# Altium project RK3568_train.PrjPcb (part 5 of 6)

## Sheet LPDDR4_4X.schdoc: =
size A3; Symbol: Sheet-Symbol_A4; Company: 嘉立创EDA; Version: V1.0; Page Size: A4; @Project Name: RK3568_LPD4X_120P_Core; @Page Count: 17; @Update Date: 2025-08-20; @Create Date: 2025-08-15; @Schematic Name: Schematic1; @Page No: 16; @Page Name: LPDDR4/4X; Device: Sheet-Symbol_A4; Border: 1; Title Block Position: 3; Width: 1655; Height: 1170; Region Start: 1; X Region Count: 6; Y Region Count: 4; Blade Width: 10; @Board Name: Board1; @Create Time: 13:51:49; @Update Time: 20:30:34; Organization: ORGANIZATION; Address1: ADDRESS 1; Address2: ADDRESS 2; Address3: ADDRESS 3; Address4: ADDRESS 4; Revision: V1.0.0; SheetNumber: 22; SheetTotal: 28
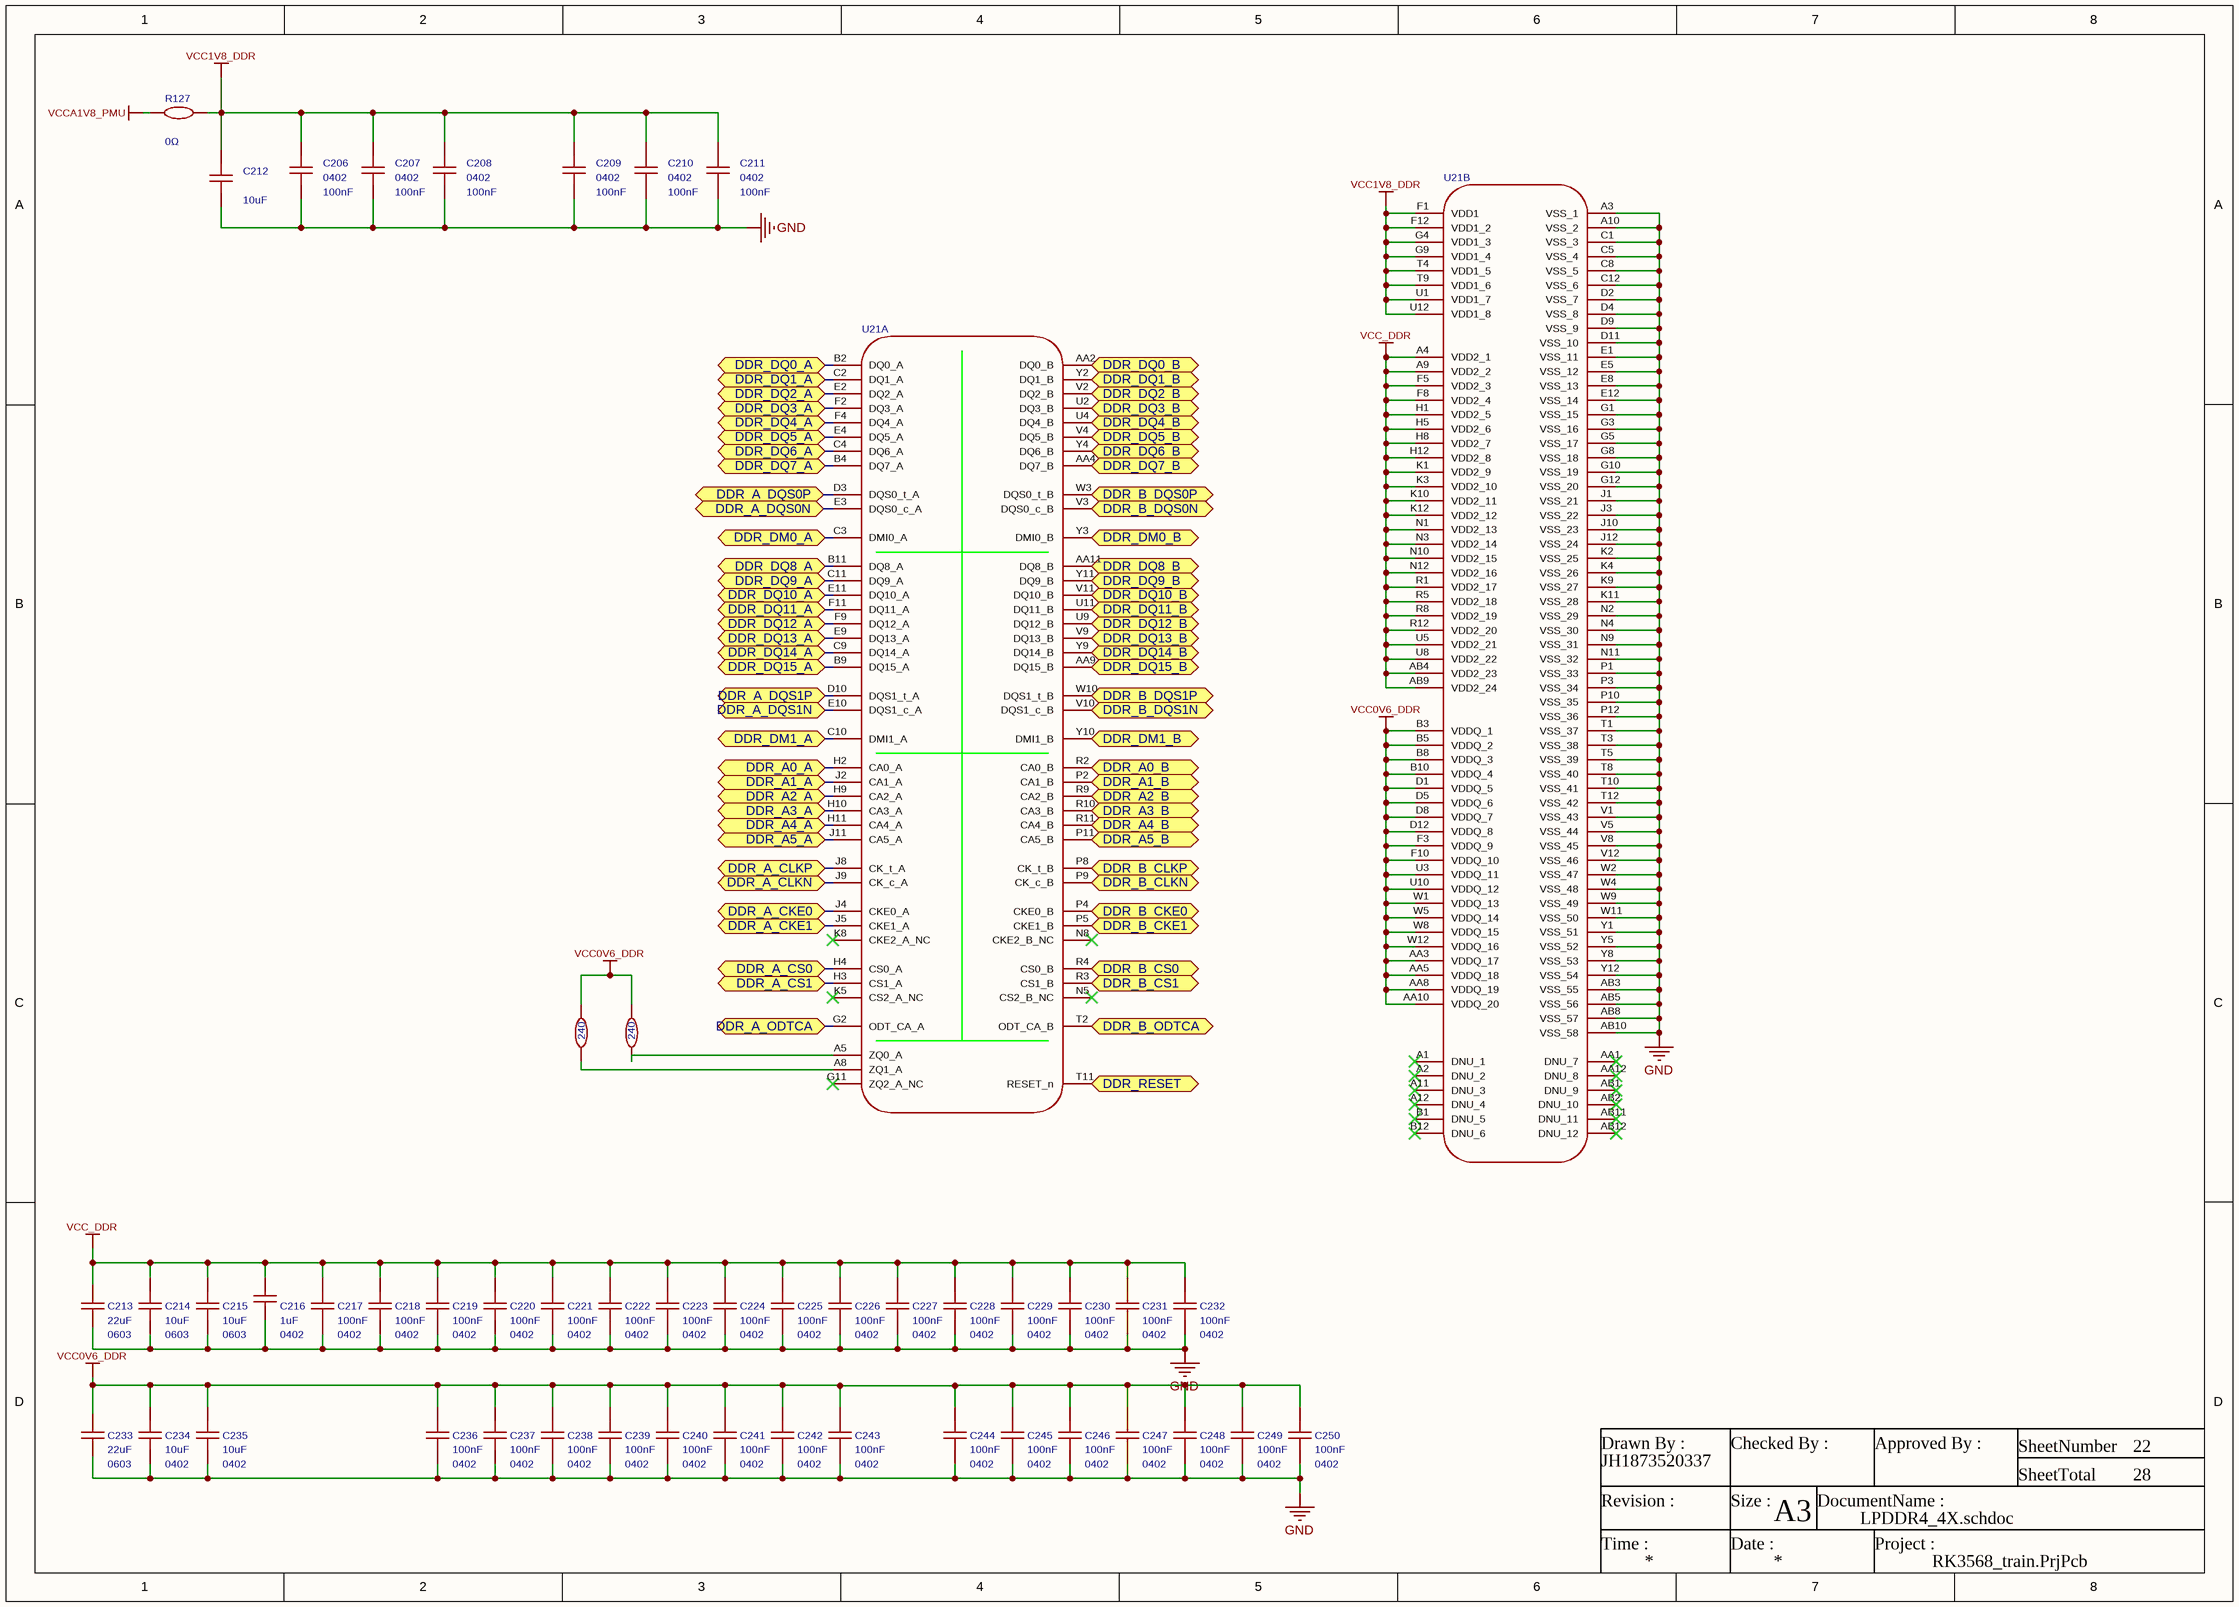
[diagram p21: LPDDR4_4X.schdoc]

### Parts
C206  100nF  Supplier Footprint: 0402  [MYC0402]
C207  100nF  Supplier Footprint: 0402  [MYC0402]
C208  100nF  Supplier Footprint: 0402  [MYC0402]
C209  100nF  Supplier Footprint: 0402  [MYC0402]
C210  100nF  Supplier Footprint: 0402  [MYC0402]
C211  100nF  Supplier Footprint: 0402  [MYC0402]
C212  10uF  [C0603]
C213  22uF  Supplier Footprint: 0603  [C0603]
C214  10uF  Supplier Footprint: 0603  [C0603]
C215  10uF  Supplier Footprint: 0603  [C0603]
C216  1uF  Supplier Footprint: 0402  [MYC0402]
C217  100nF  Supplier Footprint: 0402  [MYC0402]
C218  100nF  Supplier Footprint: 0402  [MYC0402]
C219  100nF  Supplier Footprint: 0402  [MYC0402]
C220  100nF  Supplier Footprint: 0402  [MYC0402]
C221  100nF  Supplier Footprint: 0402  [MYC0402]
C222  100nF  Supplier Footprint: 0402  [MYC0402]
C223  100nF  Supplier Footprint: 0402  [MYC0402]
C224  100nF  Supplier Footprint: 0402  [MYC0402]
C225  100nF  Supplier Footprint: 0402  [MYC0402]
C226  100nF  Supplier Footprint: 0402  [MYC0402]
C227  100nF  Supplier Footprint: 0402  [MYC0402]
C228  100nF  Supplier Footprint: 0402  [MYC0402]
C229  100nF  Supplier Footprint: 0402  [MYC0402]
C230  100nF  Supplier Footprint: 0402  [MYC0402]
C231  100nF  Supplier Footprint: 0402  [MYC0402]
C232  100nF  Supplier Footprint: 0402  [MYC0402]
C233  22uF  Supplier Footprint: 0603  [C0603]
C234  10uF  Supplier Footprint: 0402  [MYC0402]
C235  10uF  Supplier Footprint: 0402  [MYC0402]
C236  100nF  Supplier Footprint: 0402  [MYC0402]
C237  100nF  Supplier Footprint: 0402  [MYC0402]
C238  100nF  Supplier Footprint: 0402  [MYC0402]
C239  100nF  Supplier Footprint: 0402  [MYC0402]
C240  100nF  Supplier Footprint: 0402  [MYC0402]
C241  100nF  Supplier Footprint: 0402  [MYC0402]
C242  100nF  Supplier Footprint: 0402  [MYC0402]
C243  100nF  Supplier Footprint: 0402  [MYC0402]
C244  100nF  Supplier Footprint: 0402  [MYC0402]
C245  100nF  Supplier Footprint: 0402  [MYC0402]
C246  100nF  Supplier Footprint: 0402  [MYC0402]
C247  100nF  Supplier Footprint: 0402  [MYC0402]
C248  100nF  Supplier Footprint: 0402  [MYC0402]
C249  100nF  Supplier Footprint: 0402  [MYC0402]
C250  100nF  Supplier Footprint: 0402  [MYC0402]
R127  0Ω  [R0603]
R128  value 240  [r0402-nsk]  (hidden comment: Res_0402)
R129  value 240  [r0402-nsk]  (hidden comment: Res_0402)
U21  LPDDR4  [LPDDR4_MrX]  (value not drawn)  (parts A,B of 2)

### Ports
DDR_A0_A (bidir), DDR_A0_B (bidir), DDR_A1_A (bidir), DDR_A1_B (bidir), DDR_A2_A (bidir), DDR_A2_B (bidir), DDR_A3_A (bidir), DDR_A3_B (bidir), DDR_A4_A (bidir), DDR_A4_B (bidir), DDR_A5_A (bidir), DDR_A5_B (bidir), DDR_A_CKE0 (bidir), DDR_A_CKE1 (bidir), DDR_A_CLKN (bidir), DDR_A_CLKP (bidir), DDR_A_CS0 (bidir), DDR_A_CS1 (bidir), DDR_A_DQS0N (bidir), DDR_A_DQS0P (bidir), DDR_A_DQS1N (bidir), DDR_A_DQS1P (bidir), DDR_A_ODTCA (bidir), DDR_B_CKE0 (bidir), DDR_B_CKE1 (bidir), DDR_B_CLKN (bidir), DDR_B_CLKP (bidir), DDR_B_CS0 (bidir), DDR_B_CS1 (bidir), DDR_B_DQS0N (bidir), DDR_B_DQS0P (bidir), DDR_B_DQS1N (bidir), DDR_B_DQS1P (bidir), DDR_B_ODTCA (bidir), DDR_DM0_A (bidir), DDR_DM0_B (bidir), DDR_DM1_A (bidir), DDR_DM1_B (bidir), DDR_DQ0_A (bidir), DDR_DQ0_B (bidir), DDR_DQ1_A (bidir), DDR_DQ1_B (bidir), DDR_DQ2_A (bidir), DDR_DQ2_B (bidir), DDR_DQ3_A (bidir), DDR_DQ3_B (bidir), DDR_DQ4_A (bidir), DDR_DQ4_B (bidir), DDR_DQ5_A (bidir), DDR_DQ5_B (bidir), DDR_DQ6_A (bidir), DDR_DQ6_B (bidir), DDR_DQ7_A (bidir), DDR_DQ7_B (bidir), DDR_DQ8_A (bidir), DDR_DQ8_B (bidir), DDR_DQ9_A (bidir), DDR_DQ9_B (bidir), DDR_DQ10_A (bidir), DDR_DQ10_B (bidir), DDR_DQ11_A (bidir), DDR_DQ11_B (bidir), DDR_DQ12_A (bidir), DDR_DQ12_B (bidir), DDR_DQ13_A (bidir), DDR_DQ13_B (bidir), DDR_DQ14_A (bidir), DDR_DQ14_B (bidir), DDR_DQ15_A (bidir), DDR_DQ15_B (bidir), DDR_RESET (bidir)

### Nets
GND: C206.1 C207.1 C208.1 C209.1 C210.1 C211.1 C212.1 C213.1 C214.1 C215.1 C216.1 C217.2 C218.2 C219.2 C220.2 C221.2 C222.2 C223.2 C224.2 C225.2 C226.2 C227.2 C228.2 C229.2 C230.2 C231.2 C232.2 C233.1 C234.1 C235.1 C236.2 C237.2 C238.2 C239.2 C240.2 C241.2 C242.2 C243.2 C244.2 C245.2 C246.2 C247.2 C248.2 C249.2 C250.2 U21.A3(VSS_1) U21.A10(VSS_2) U21.AB3(VSS_55) U21.AB5(VSS_56) U21.AB8(VSS_57) U21.AB10(VSS_58) U21.C1(VSS_3) U21.C5(VSS_4) U21.C8(VSS_5) U21.C12(VSS_6) U21.D2(VSS_7) U21.D4(VSS_8) U21.D9(VSS_9) U21.D11(VSS_10) U21.E1(VSS_11) U21.E5(VSS_12) U21.E8(VSS_13) U21.E12(VSS_14) U21.G1(VSS_15) U21.G3(VSS_16) U21.G5(VSS_17) U21.G8(VSS_18) U21.G10(VSS_19) U21.G12(VSS_20) U21.J1(VSS_21) U21.J3(VSS_22) U21.J10(VSS_23) U21.J12(VSS_24) U21.K2(VSS_25) U21.K4(VSS_26) U21.K9(VSS_27) U21.K11(VSS_28) U21.N2(VSS_29) U21.N4(VSS_30) U21.N9(VSS_31) U21.N11(VSS_32) U21.P1(VSS_33) U21.P3(VSS_34) U21.P10(VSS_35) U21.P12(VSS_36) U21.T1(VSS_37) U21.T3(VSS_38) U21.T5(VSS_39) U21.T8(VSS_40) U21.T10(VSS_41) U21.T12(VSS_42) U21.V1(VSS_43) U21.V5(VSS_44) U21.V8(VSS_45) U21.V12(VSS_46) U21.W2(VSS_47) U21.W4(VSS_48) U21.W9(VSS_49) U21.W11(VSS_50) U21.Y1(VSS_51) U21.Y5(VSS_52) U21.Y8(VSS_53) U21.Y12(VSS_54)
VCC0V6_DDR: C233.2 C234.2 C235.2 C236.1 C237.1 C238.1 C239.1 C240.1 C241.1 C242.1 C243.1 C244.1 C245.1 C246.1 C247.1 C248.1 C249.1 C250.1 R128.2 R129.2 U21.AA3(VDDQ_17) U21.AA5(VDDQ_18) U21.AA8(VDDQ_19) U21.AA10(VDDQ_20) U21.B3(VDDQ_1) U21.B5(VDDQ_2) U21.B8(VDDQ_3) U21.B10(VDDQ_4) U21.D1(VDDQ_5) U21.D5(VDDQ_6) U21.D8(VDDQ_7) U21.D12(VDDQ_8) U21.F3(VDDQ_9) U21.F10(VDDQ_10) U21.U3(VDDQ_11) U21.U10(VDDQ_12) U21.W1(VDDQ_13) U21.W5(VDDQ_14) U21.W8(VDDQ_15) U21.W12(VDDQ_16)
VCC1V8_DDR: C206.2 C207.2 C208.2 C209.2 C210.2 C211.2 C212.2 R127.1 U21.F1(VDD1) U21.F12(VDD1_2) U21.G4(VDD1_3) U21.G9(VDD1_4) U21.T4(VDD1_5) U21.T9(VDD1_6) U21.U1(VDD1_7) U21.U12(VDD1_8)
VCC_DDR: C213.2 C214.2 C215.2 C216.2 C217.1 C218.1 C219.1 C220.1 C221.1 C222.1 C223.1 C224.1 C225.1 C226.1 C227.1 C228.1 C229.1 C230.1 C231.1 C232.1 U21.A4(VDD2_1) U21.A9(VDD2_2) U21.AB4(VDD2_23) U21.AB9(VDD2_24) U21.F5(VDD2_3) U21.F8(VDD2_4) U21.H1(VDD2_5) U21.H5(VDD2_6) U21.H8(VDD2_7) U21.H12(VDD2_8) U21.K1(VDD2_9) U21.K3(VDD2_10) U21.K10(VDD2_11) U21.K12(VDD2_12) U21.N1(VDD2_13) U21.N3(VDD2_14) U21.N10(VDD2_15) U21.N12(VDD2_16) U21.R1(VDD2_17) U21.R5(VDD2_18) U21.R8(VDD2_19) U21.R12(VDD2_20) U21.U5(VDD2_21) U21.U8(VDD2_22)
VCCA1V8_PMU: R127.2
DDR_A0_A: U21.H2(CA0_A) ; port DDR_A0_A
DDR_A0_B: U21.R2(CA0_B) ; port DDR_A0_B
DDR_A1_A: U21.J2(CA1_A) ; port DDR_A1_A
DDR_A1_B: U21.P2(CA1_B) ; port DDR_A1_B
DDR_A2_A: U21.H9(CA2_A) ; port DDR_A2_A
DDR_A2_B: U21.R9(CA2_B) ; port DDR_A2_B
DDR_A3_A: U21.H10(CA3_A) ; port DDR_A3_A
DDR_A3_B: U21.R10(CA3_B) ; port DDR_A3_B
DDR_A4_A: U21.H11(CA4_A) ; port DDR_A4_A
DDR_A4_B: U21.R11(CA4_B) ; port DDR_A4_B
DDR_A5_A: U21.J11(CA5_A) ; port DDR_A5_A
DDR_A5_B: U21.P11(CA5_B) ; port DDR_A5_B
DDR_A_CKE0: U21.J4(CKE0_A) ; port DDR_A_CKE0
DDR_A_CKE1: U21.J5(CKE1_A) ; port DDR_A_CKE1
DDR_A_CLKN: U21.J9(CK_c_A) ; port DDR_A_CLKN
DDR_A_CLKP: U21.J8(CK_t_A) ; port DDR_A_CLKP
DDR_A_CS0: U21.H4(CS0_A) ; port DDR_A_CS0
DDR_A_CS1: U21.H3(CS1_A) ; port DDR_A_CS1
DDR_A_DQS0N: U21.E3(DQS0_c_A) ; port DDR_A_DQS0N
DDR_A_DQS0P: U21.D3(DQS0_t_A) ; port DDR_A_DQS0P
DDR_A_DQS1N: U21.E10(DQS1_c_A) ; port DDR_A_DQS1N
DDR_A_DQS1P: U21.D10(DQS1_t_A) ; port DDR_A_DQS1P
DDR_A_ODTCA: U21.G2(ODT_CA_A) ; port DDR_A_ODTCA
DDR_B_CKE0: U21.P4(CKE0_B) ; port DDR_B_CKE0
DDR_B_CKE1: U21.P5(CKE1_B) ; port DDR_B_CKE1
DDR_B_CLKN: U21.P9(CK_c_B) ; port DDR_B_CLKN
DDR_B_CLKP: U21.P8(CK_t_B) ; port DDR_B_CLKP
DDR_B_CS0: U21.R4(CS0_B) ; port DDR_B_CS0
DDR_B_CS1: U21.R3(CS1_B) ; port DDR_B_CS1
DDR_B_DQS0N: U21.V3(DQS0_c_B) ; port DDR_B_DQS0N
DDR_B_DQS0P: U21.W3(DQS0_t_B) ; port DDR_B_DQS0P
DDR_B_DQS1N: U21.V10(DQS1_c_B) ; port DDR_B_DQS1N
DDR_B_DQS1P: U21.W10(DQS1_t_B) ; port DDR_B_DQS1P
DDR_B_ODTCA: U21.T2(ODT_CA_B) ; port DDR_B_ODTCA
DDR_DM0_A: U21.C3(DMI0_A) ; port DDR_DM0_A
DDR_DM0_B: U21.Y3(DMI0_B) ; port DDR_DM0_B
DDR_DM1_A: U21.C10(DMI1_A) ; port DDR_DM1_A
DDR_DM1_B: U21.Y10(DMI1_B) ; port DDR_DM1_B
DDR_DQ0_A: U21.B2(DQ0_A) ; port DDR_DQ0_A
DDR_DQ0_B: U21.AA2(DQ0_B) ; port DDR_DQ0_B
DDR_DQ1_A: U21.C2(DQ1_A) ; port DDR_DQ1_A
DDR_DQ1_B: U21.Y2(DQ1_B) ; port DDR_DQ1_B
DDR_DQ2_A: U21.E2(DQ2_A) ; port DDR_DQ2_A
DDR_DQ2_B: U21.V2(DQ2_B) ; port DDR_DQ2_B
DDR_DQ3_A: U21.F2(DQ3_A) ; port DDR_DQ3_A
DDR_DQ3_B: U21.U2(DQ3_B) ; port DDR_DQ3_B
DDR_DQ4_A: U21.F4(DQ4_A) ; port DDR_DQ4_A
DDR_DQ4_B: U21.U4(DQ4_B) ; port DDR_DQ4_B
DDR_DQ5_A: U21.E4(DQ5_A) ; port DDR_DQ5_A
DDR_DQ5_B: U21.V4(DQ5_B) ; port DDR_DQ5_B
DDR_DQ6_A: U21.C4(DQ6_A) ; port DDR_DQ6_A
DDR_DQ6_B: U21.Y4(DQ6_B) ; port DDR_DQ6_B
DDR_DQ7_A: U21.B4(DQ7_A) ; port DDR_DQ7_A
DDR_DQ7_B: U21.AA4(DQ7_B) ; port DDR_DQ7_B
DDR_DQ8_A: U21.B11(DQ8_A) ; port DDR_DQ8_A
DDR_DQ8_B: U21.AA11(DQ8_B) ; port DDR_DQ8_B
DDR_DQ9_A: U21.C11(DQ9_A) ; port DDR_DQ9_A
DDR_DQ9_B: U21.Y11(DQ9_B) ; port DDR_DQ9_B
DDR_DQ10_A: U21.E11(DQ10_A) ; port DDR_DQ10_A
DDR_DQ10_B: U21.V11(DQ10_B) ; port DDR_DQ10_B
DDR_DQ11_A: U21.F11(DQ11_A) ; port DDR_DQ11_A
DDR_DQ11_B: U21.U11(DQ11_B) ; port DDR_DQ11_B
DDR_DQ12_A: U21.F9(DQ12_A) ; port DDR_DQ12_A
DDR_DQ12_B: U21.U9(DQ12_B) ; port DDR_DQ12_B
DDR_DQ13_A: U21.E9(DQ13_A) ; port DDR_DQ13_A
DDR_DQ13_B: U21.V9(DQ13_B) ; port DDR_DQ13_B
DDR_DQ14_A: U21.C9(DQ14_A) ; port DDR_DQ14_A
DDR_DQ14_B: U21.Y9(DQ14_B) ; port DDR_DQ14_B
DDR_DQ15_A: U21.B9(DQ15_A) ; port DDR_DQ15_A
DDR_DQ15_B: U21.AA9(DQ15_B) ; port DDR_DQ15_B
DDR_RESET: U21.T11(RESET_n) ; port DDR_RESET
NetR128_1: R128.1 U21.A8(ZQ1_A)
NetR129_1: R129.1 U21.A5(ZQ0_A)

Not connected (* = marked no-connect by the designer): U21 A1(DNU_1)* A2(DNU_2)* A11(DNU_3)* A12(DNU_4)* AA1(DNU_7)* AA12(DNU_8)* AB1(DNU_9)* AB2(DNU_10)* AB11(DNU_11)* AB12(DNU_12)* B1(DNU_5)* B12(DNU_6)* G11(ZQ2_A_NC)* K5(CS2_A_NC)* K8(CKE2_A_NC)* N5(CS2_B_NC)* N8(CKE2_B_NC)*

### Notes on the sheet
- Drawn By :
- Checked By :
- Approved By :
- SheetNumber
- SheetTotal
- Revision :
- Time :
- Size :
- Date :
- A3
- DocumentName :
- Project :

### Library data of the parts
C206-C211 C217-C232 C236-C250 = CL05B104KB54PNC: 容值:100nF;精度:±10%;额定电压:50V;材质(温度系数):X7R;; Manufacturer: SAMSUNG(三星); Symbol: CL03A104KO3NNNC; AddInBom: yes; ModelId: 36a51122f27c49738f86b3bfa98863e0; ModelName: C0402_L1.0-W0.5-H0.5; ModelTransform: 39.37,19.685,0,0,0,0,0,0,0; Tolerance: ±10%; Voltage Rated: 50V; Temperature Coefficient: X7R; Device: CL05B104KB54PNC; LCSC Part Name: 100nF ±10% 50V; SupplierPart: C307331; ManufacturerPart: CL05B104KB54PNC; JLCPCB Part Class: Basic Part; Datasheet: https://atta.szlcsc.com/upload/public/pdf/source/20181009/C307331_222F7C870FD3EA5F46F538B483443886.pdf; Supplier: LCSC; ConvertToPcb: yes; FootprintName: MYC0402; Value: 100nF
C212 C214 C215 = CL10A106KP8NNNC: 容值:10uF;精度:±10%;额定电压:10V;材质(温度系数):X5R;; Manufacturer: SAMSUNG(三星); Symbol: 0603X106M100; AddInBom: yes; ModelId: ac125912035d415993ca9572d50418b1; ModelName: C0603_L1.6-W0.8-H0.8; ModelTransform: 62.992,31.496,0,0,0,0,0,0,0; Tolerance: ±10%; Voltage Rated: 10V; Temperature Coefficient: X5R; Device: CL10A106KP8NNNC; LCSC Part Name: 10uF ±10% 10V; SupplierPart: C19702; ManufacturerPart: CL10A106KP8NNNC; JLCPCB Part Class: Basic Part; Datasheet: https://atta.szlcsc.com/upload/public/pdf/source/20160103/1457707703378.pdf; Supplier: LCSC; ConvertToPcb: yes; FootprintName: C0603; Value: 10uF
  C212: Supplier Footprint: 0603
C213 C233 = CL10A226MQ8NRNC: 容值:22uF;精度:±20%;额定电压:6.3V;材质(温度系数):X5R;; Manufacturer: SAMSUNG(三星); Symbol: GRT188R61A226ME13D; AddInBom: yes; ModelId: ac125912035d415993ca9572d50418b1; ModelName: C0603_L1.6-W0.8-H0.8; ModelTransform: 62.992,31.496,0,0,0,0,0,0,0; Tolerance: ±20%; Voltage Rated: 6.3V; Temperature Coefficient: X5R; Device: CL10A226MQ8NRNC; LCSC Part Name: 22uF ±20% 6.3V; SupplierPart: C59461; ManufacturerPart: CL10A226MQ8NRNC; JLCPCB Part Class: Basic Part; Datasheet: https://atta.szlcsc.com/upload/public/pdf/source/20160218/1457707763339.pdf; Supplier: LCSC; ConvertToPcb: yes; FootprintName: C0603; Value: 22uF
C216 = CL05A105KP5NNNC: 容值:1uF;精度:±10%;额定电压:10V;材质(温度系数):X5R;; Manufacturer: SAMSUNG(三星); AddInBom: yes; ModelId: 36a51122f27c49738f86b3bfa98863e0; ModelName: C0402_L1.0-W0.5-H0.5; ModelTransform: 39.37,19.685,0,0,0,0,0,0,0; Tolerance: ±10%; Voltage Rated: 10V; Temperature Coefficient: X5R; Device: CL05A105KP5NNNC; Symbol: CL05A105KP5NNNC; LCSC Part Name: 1uF ±10% 10V; SupplierPart: C14445; ManufacturerPart: CL05A105KP5NNNC; JLCPCB Part Class: 扩展库; Datasheet: https://atta.szlcsc.com/upload/public/pdf/source/20160103/1457707670698.pdf; Supplier: LCSC; ConvertToPcb: yes; FootprintName: MYC0402; Value: 1uF
C234 C235 = CL05A106MQ5NUNC: 容值:10uF;精度:±20%;额定电压:6.3V;材质(温度系数):X5R;; Manufacturer: SAMSUNG(三星); Symbol: 0603X106M100; AddInBom: yes; ModelId: 36a51122f27c49738f86b3bfa98863e0; ModelName: C0402_L1.0-W0.5-H0.5; ModelTransform: 39.37,19.685,0,0,0,0,0,0,0; Tolerance: ±20%; Voltage Rated: 6.3V; Temperature Coefficient: X5R; JLCPCB Part Class: Basic Part; Device: CL05A106MQ5NUNC; LCSC Part Name: 10uF ±20% 6.3V; SupplierPart: C15525; ManufacturerPart: CL05A106MQ5NUNC; Datasheet: https://atta.szlcsc.com/upload/public/pdf/source/20220823/2B02EE04F8F211D38A52DCB16EB6BEBA.pdf; Supplier: LCSC; ConvertToPcb: yes; FootprintName: MYC0402; Value: 10uF
R127 = 0603WAF0000T5E: 电阻类型:厚膜电阻;阻值:0Ω;精度:±1%;功率:100mW;最大工作电压:75V;工作温度范围:-55℃~+155℃;; Manufacturer: UNI-ROYAL(厚声); AddInBom: yes; ModelId: 6bd5cd867e9542ebae21caaf5d2d4c4d; ModelTransform: 31.8897,63.7794,0,90,0,0,0,0,0; Tolerance: ±1%; Power(Watts): 100mW; Overload Voltage (Max): 75V; Device: 0603WAF0000T5E; Symbol: 0603WAF0000T5E; LCSC Part Name: 0Ω ±1% 100mW; SupplierPart: C21189; ManufacturerPart: 0603WAF0000T5E; Supplier Footprint: 0603; JLCPCB Part Class: Basic Part; Datasheet: https://atta.szlcsc.com/upload/public/pdf/source/20200306/C422600_1E6D84923E4A46A82E41ADD87F860B5C.pdf; Supplier: LCSC; ConvertToPcb: yes; FootprintName: R0603; ModelName: R0603; Type: 厚膜电阻; Value: 0Ω; Operating Temperature Range: -55℃~+155℃
R128 R129 = Res_0402: Symbol: 电阻; Check: false; ConvertToPcb: yes; ModelId: 671aefced39d4c318694bba8bd8efd39; ModelName: R0402_L1.0-W0.5-H0.5; ModelTransform: 39.37,19.685,0,0,0,0,0,0.0005,0; Device: Res_0402; AddInBom: yes; Supplier Footprint: 0402; FootprintName: r0402-nsk
U21 = LPDDR4: Check: false; AddInBom: yes; Device: LPDDR4; ConvertToPcb: yes; SymbolName: LPDDR4; FootprintName: LPDDR4_MrX

## Sheet EMMC.schdoc: =
size A4; Symbol: Sheet-Symbol_A4; Company: 嘉立创EDA; Version: V1.0; Page Size: A4; @Project Name: RK3568B2地瓜派; @Page Count: 27; @Update Date: 2025-09-11; @Create Date: 2025-09-11; @Schematic Name: Schematic1; @Page No: 17; @Page Name: EMMC; Device: Sheet-Symbol_A4; Border: 1; Title Block Position: 3; Width: 1170; Height: 825; Region Start: 1; X Region Count: 6; Y Region Count: 4; Blade Width: 10; @Board Name: Board1; @Create Time: 22:14:46; @Update Time: 22:15:06; Organization: ORGANIZATION; Address1: ADDRESS 1; Address2: ADDRESS 2; Address3: ADDRESS 3; Address4: ADDRESS 4; Revision: V1.0.0; SheetNumber: 23; SheetTotal: 28
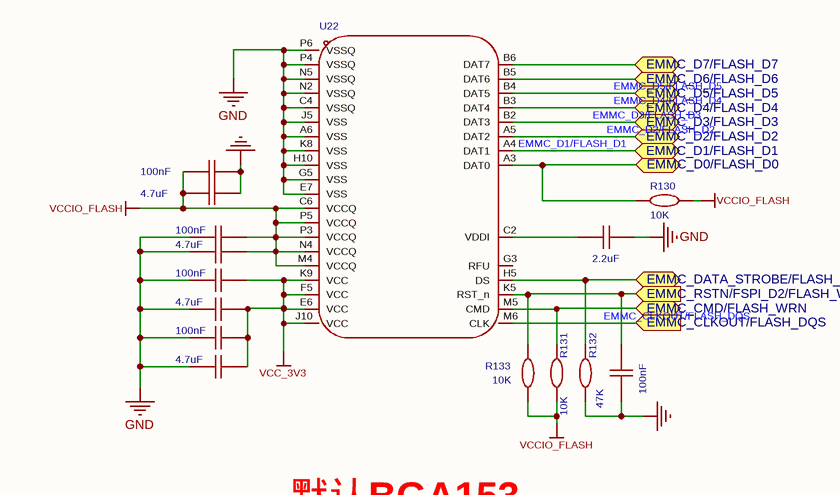
[diagram p22: EMMC.schdoc]

### Parts
C251  100nF  [c0402-nsk]
C252  4.7uF  [c0402-nsk]
C253  100nF  [c0402-nsk]
C254  4.7uF  [c0402-nsk]
C255  value 2.2uF  [c0402-nsk]  (hidden comment: CL10A225KO8NNNC)
C256  100nF  [c0402-nsk]
C257  4.7uF  [c0402-nsk]
C258  100nF  [c0402-nsk]
C259  4.7uF  [c0402-nsk]
C260  value 100nF  [c0402-nsk]  (hidden comment: CL10A475KO8NNNC)
R130  10K  [R0402]
R131  10K  [R0402]
R132  47K  [R0402]
R133  10K  [R0402]
U22  (no value)  [fbga-153_l13.0-w11.5-p0.50_klmag1jetd-b041]

### Ports
EMMC_CLKOUT/FLASH_DQS (in), EMMC_CMD/FLASH_WRN (bidir), EMMC_D0/FLASH_D0 (bidir), EMMC_D1/FLASH_D1 (bidir), EMMC_D2/FLASH_D2 (bidir), EMMC_D3/FLASH_D3 (bidir), EMMC_D4/FLASH_D4 (bidir), EMMC_D5/FLASH_D5 (bidir), EMMC_D6/FLASH_D6 (bidir), EMMC_D7/FLASH_D7 (bidir), EMMC_DATA_STROBE/FLASH_CLE (bidir), EMMC_RSTN/FSPI_D2/FLASH_WPN (in)

### Nets
GND: C251.2 C252.2 C253.1 C254.1 C255.1 C256.1 C257.1 C258.1 C259.1 C260.1 R132.1 U22.A6(VSS) U22.C4(VSSQ) U22.E7(VSS) U22.G5(VSS) U22.H10(VSS) U22.J5(VSS) U22.K8(VSS) U22.N2(VSSQ) U22.N5(VSSQ) U22.P4(VSSQ) U22.P6(VSSQ)
VCC_3V3: C256.2 C257.2 C258.2 C259.2 U22.E6(VCC) U22.F5(VCC) U22.J10(VCC) U22.K9(VCC)  [project net TP_3V3]
VCCIO_FLASH: C251.1 C252.1 C253.2 C254.2 R130.2 R131.1 R133.1 U22.C6(VCCQ) U22.M4(VCCQ) U22.N4(VCCQ) U22.P3(VCCQ) U22.P5(VCCQ)
EMMC_CLKOUT/FLASH_DQS: U22.M6(CLK) ; port EMMC_CLKOUT/FLASH_DQS
EMMC_CMD/FLASH_WRN: R131.2 U22.M5(CMD) ; port EMMC_CMD/FLASH_WRN
EMMC_D0/FLASH_D0: R130.1 U22.A3(DAT0) ; port EMMC_D0/FLASH_D0
EMMC_D1/FLASH_D1: U22.A4(DAT1) ; port EMMC_D1/FLASH_D1
EMMC_D2/FLASH_D2: U22.A5(DAT2) ; port EMMC_D2/FLASH_D2
EMMC_D3/FLASH_D3: U22.B2(DAT3) ; port EMMC_D3/FLASH_D3
EMMC_D4/FLASH_D4: U22.B3(DAT4) ; port EMMC_D4/FLASH_D4
EMMC_D5/FLASH_D5: U22.B4(DAT5) ; port EMMC_D5/FLASH_D5
EMMC_D6/FLASH_D6: U22.B5(DAT6) ; port EMMC_D6/FLASH_D6
EMMC_D7/FLASH_D7: U22.B6(DAT7) ; port EMMC_D7/FLASH_D7
EMMC_DATA_STROBE/FLASH_CLE: R132.2 U22.H5(DS) ; port EMMC_DATA_STROBE/FLASH_CLE
EMMC_RSTN/FSPI_D2/FLASH_WPN: C260.2 R133.2 U22.K5(RST_n) ; port EMMC_RSTN/FSPI_D2/FLASH_WPN
NetC255_2: C255.2 U22.C2(VDDI)

Not connected (* = marked no-connect by the designer): U22 G3(RFU)

### Notes on the sheet
- 默认BGA153
- Drawn By :
- Checked By :
- Approved By :
- SheetNumber
- SheetTotal
- Revision :
- Time :
- Size :
- Date :
- A4
- DocumentName :
- Project :

### Library data of the parts
C251 C253 C256 C258 = CC0603KRX7R9BB104: 容值:100nF;精度:±10%;额定电压:50V;材质(温度系数):X7R;; Manufacturer: YAGEO(国巨); Symbol: CapAcitance; AddInBom: yes; ModelId: ac125912035d415993ca9572d50418b1; ModelName: C0603_L1.6-W0.8-H0.8; ModelTransform: 62.992,31.496,0,0,0,0,0,0,0; Tolerance: ±10%; Voltage Rated: 50V; Temperature Coefficient: X7R; Value: 100nF; Device: CC0603KRX7R9BB104; LCSC Part Name: 100nF ±10% 50V; SupplierPart: C14663; ManufacturerPart: CC0603KRX7R9BB104; Supplier Footprint: 0603; JLCPCB Part Class: Basic Part; Datasheet: https://atta.szlcsc.com/upload/public/pdf/source/20180910/C282072_33301C7F631E79921B82A8DAC6BCC5B3.pdf; Supplier: LCSC; ConvertToPcb: yes; FootprintName: c0402-nsk
C252 C254 C257 C259 C260 = CL10A475KO8NNNC: 容值:4.7uF;精度:±10%;额定电压:16V;材质(温度系数):X5R;; Manufacturer: SAMSUNG(三星); Symbol: CapAcitance; AddInBom: yes; ModelId: ac125912035d415993ca9572d50418b1; ModelName: C0603_L1.6-W0.8-H0.8; ModelTransform: 62.992,31.496,0,0,0,0,0,0,0; Tolerance: ±10%; Voltage Rated: 16V; Temperature Coefficient: X5R; Device: CL10A475KO8NNNC; LCSC Part Name: 4.7uF ±10% 16V; ManufacturerPart: CL10A475KO8NNNC; Supplier Footprint: 0603; JLCPCB Part Class: Basic Part; Datasheet: https://atta.szlcsc.com/upload/public/pdf/source/20160103/1457707703134.pdf; Supplier: LCSC; ConvertToPcb: yes; FootprintName: c0402-nsk
  C252 C254 C257 C259: Value: 4.7uF; SupplierPart: C19666
C255 = CL10A225KO8NNNC: 容值:2.2uF;精度:±10%;额定电压:16V;材质(温度系数):X5R;; Manufacturer: SAMSUNG(三星); Symbol: CapAcitance; AddInBom: yes; ModelId: ac125912035d415993ca9572d50418b1; ModelName: C0603_L1.6-W0.8-H0.8; ModelTransform: 62.992,31.496,0,0,0,0,0,0,0; Tolerance: ±10%; Voltage Rated: 16V; Temperature Coefficient: X5R; Device: CL10A225KO8NNNC; Supplier Part: C23630; LCSC Part Name: 2.2uF ±10% 16V; ManufacturerPart: CL10A225KO8NNNC; Supplier Footprint: 0603; JLCPCB Part Class: Basic Part; Datasheet: https://atta.szlcsc.com/upload/public/pdf/source/20160103/1457707709512.pdf; Supplier: LCSC; ConvertToPcb: yes; FootprintName: c0402-nsk
R130-R133 = Res_0402: Symbol: 电阻; ConvertToPcb: yes; ModelId: 671aefced39d4c318694bba8bd8efd39; ModelName: R0402_L1.0-W0.5-H0.5; ModelTransform: 39.37,19.685,0,0,0,0,0,0.0005,0; Device: Res_0402; AddInBom: yes; Supplier Footprint: 0402; FootprintName: R0402
  R130 R131 R133: Value: 10K
  R132: Value: 47K
U22 = EMMC BGA153: Manufacturer: Kingston(金士顿); ManufacturerPart: EMMC04G-M627-A01; Pin Type: IN; AddInBom: yes; Device: EMMC BGA153; Symbol: EMMC BGA153; Supplier: LCSC; SupplierPart: C577446; ConvertToPcb: yes; FootprintName: fbga-153_l13.0-w11.5-p0.50_klmag1jetd-b041

## Sheet AUDIO.schdoc: =
size A4; Symbol: Sheet-Symbol_A4; Company: 嘉立创EDA; Version: V1.0; Page Size: A4; @Project Name: RK3568B2地瓜派; @Page Count: 27; @Update Date: 2025-09-15; @Create Date: 2025-09-11; @Schematic Name: Schematic1; @Page No: 24; @Page Name: AUDIO; Device: Sheet-Symbol_A4; Border: 1; Title Block Position: 3; Width: 1170; Height: 825; Region Start: 1; X Region Count: 6; Y Region Count: 4; Blade Width: 10; @Board Name: Board1; @Create Time: 22:30:13; @Update Time: 13:47:58; Organization: ORGANIZATION; Address1: ADDRESS 1; Address2: ADDRESS 2; Address3: ADDRESS 3; Address4: ADDRESS 4; Revision: V1.0.0; SheetNumber: 24; SheetTotal: 28
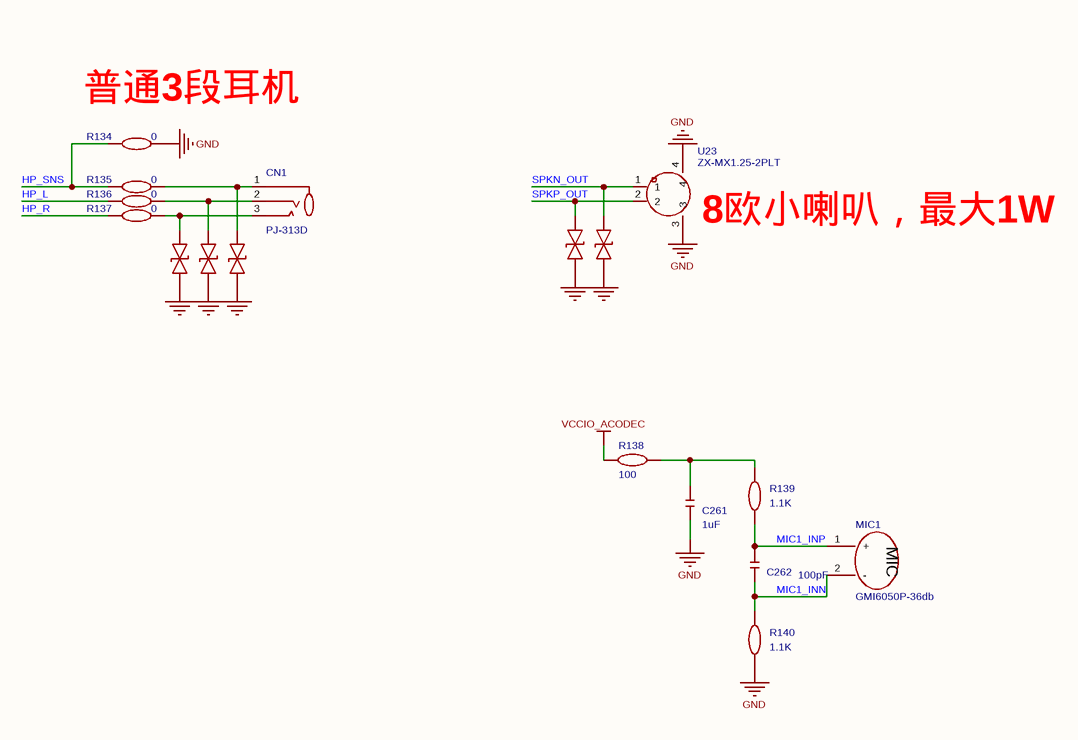
[diagram p23: AUDIO.schdoc]

### Parts
C261  1uF  [MYC0402]
C262  100pF  [MYC0402]
CN1  PJ-313D  [AUDIO-SMD_PJ-313D-2]
MIC1  GMI6050P-36db  [MIC-TH_BD6.0-P1.90-D0.4-L-FD_GMI6050P-2CXXDB]
R134  0  [R0402]
R135  0  [R0402]
R136  0  [R0402]
R137  0  [R0402]
R138  100  [R0402]
R139  1.1K  [R0402]
R140  1.1K  [R0402]
U23  ZX-MX1.25-2PLT  [CONN-SMD_2P-P1.25-MX1.25-2P-LT]
U24  ESD5341N  [DFN1006-2L-BI]  (value not drawn)
U25  ESD5341N  [DFN1006-2L-BI]  (value not drawn)
U26  ESD5341N  [DFN1006-2L-BI]  (value not drawn)
U27  ESD5341N  [DFN1006-2L-BI]  (value not drawn)
U28  ESD5341N  [DFN1006-2L-BI]  (value not drawn)

### Nets
GND: C261.1 R134.2 R140.1 U23.3 U23.4 U24.1 U25.1 U26.1 U27.1 U28.1
VCCIO_ACODEC: R138.2
HP_L: R136.1
HP_R: R137.1
HP_SNS: R134.1 R135.1
MIC1_INN: C262.1 MIC1.2(-) R140.2
MIC1_INP: C262.2 MIC1.1(+) R139.1
SPKN_OUT: U23.1 U25.2
SPKP_OUT: U23.2 U24.2
NetC261_2: C261.2 R138.1 R139.2
NetCN1_1: CN1.1 R135.2 U28.2
NetCN1_2: CN1.2 R136.2 U27.2
NetCN1_3: CN1.3 R137.2 U26.2

### Notes on the sheet
- (near R134) 普通3段耳机
- 8欧小喇叭，最大1W
- Drawn By :
- Checked By :
- Approved By :
- SheetNumber
- SheetTotal
- Revision :
- Time :
- Size :
- Date :
- A4
- DocumentName :
- Project :
- (in symbol GMI6050P-36db) MIC

### Library data of the parts
C261 C262 = MYC0402: C0402电容; Symbol: MY_C0201; AddInBom: yes; Device: MYC0402; ConvertToPcb: yes; FootprintName: MYC0402
  C261: Value: 1uF
  C262: Value: 100pF
CN1 = PJ-313D_C668608: 连接器类型:3.5mm耳机座;额定电流:500mA;额定电压:30V;触头材质:铜;触头镀层:银;工作温度范围:-30℃~+70℃;; Manufacturer: SHOU HAN(首韩); AddInBom: yes; ModelId: 4c414bff0d4f41fcb665cbf6b08ddc6c; ModelTransform: 334.645,551.18,0,0,0,0,0,19.685,-19.685; Current Rating (Max): 500mA; Voltage Rating (Max): 30V; Symbol: PJ-313D_C668608; Device: PJ-313D_C668608; LCSC Part Name: 3.5mm耳机座; SupplierPart: C668608; ManufacturerPart: PJ-313D; Supplier Footprint: SMD; JLCPCB Part Class: 扩展库; Datasheet: https://atta.szlcsc.com/upload/public/pdf/source/20200618/C668608_AB2020DBBA26E8897834D328F2FA3C40.pdf; Supplier: LCSC; ConvertToPcb: yes; FootprintName: AUDIO-SMD_PJ-313D-2; ModelName: AUDIO-SMD_PJ-313D-2; Connector Type: 3.5mm耳机座; Contact Material: 铜; Contact Plating: 银; Operating Temperature Range: -30℃~+70℃
MIC1 = GMI6050P-36db: Manufacturer: INGHAi(赢海); AddInBom: yes; ModelId: 13bff40b06b543799f1cf39aeb3f973a聨0819f05c4eef4c71ace90d822a990e87; ModelTransform: 236.22,235.915,0,0,0,0,0,-0.003,-118.11; Symbol: GMI6050P-36DB; Device: GMI6050P-36db; LCSC Part Name: 全指向φ6.0*5.0mm 1.5V-10V 灵敏度-36db 低阻抗 针脚; SupplierPart: C233939; ManufacturerPart: GMI6050P-36db; Supplier Footprint: 插件,D=6mm; JLCPCB Part Class: Extended Part; Datasheet: https://atta.szlcsc.com/upload/public/pdf/source/20180613/C233951_CF3F103FE3546E5F8FCD1BC0597FF08F.pdf; Supplier: LCSC; ConvertToPcb: yes; FootprintName: MIC-TH_BD6.0-P1.90-D0.4-L-FD_GMI6050P-2CXXDB; ModelName: MIC-TH_BD6.0-P1.90-D0.4-L-FD_GMI6050P-2CXXDB
R134 R138-R140 = Res_0402: Symbol: 电阻; 3D Model: 671aefced39d4c318694bba8bd8efd39; 3D Model Transform: 39.37,19.685,0,0,0,0,0,0.0005,0; ConvertToPcb: yes; ModelName: R0402_L1.0-W0.5-H0.5; Device: Res_0402; Supplier Footprint: 0402; AddInBom: yes; FootprintName: R0402
  R134: Value: 0
  R138: Value: 100
  R139 R140: Value: 1.1K
R135-R137 = Res_0402: as R130-R133 on sheet EMMC; Value: 0; Device: Res_0402; AddInBom: yes; Supplier Footprint: 0402; FootprintName: R0402
U23 = ZX-MX1.25-2PLT: 插针结构:1x2P;间距:1.25mm;安装方式:立贴;参考系列:PicoBlade(MX 1.25);总PIN数:2P;排数:1;每排PIN数:2;行距:-;额定电流:1A;触头材质:黄铜;触头镀层:锡;工作温度:-25℃~+85℃;; Manufacturer: Megastar(兆星); AddInBom: yes; ModelId: 48bd7d836b6f42088ab475ec0682dcba聨0819f05c4eef4c71ace90d822a990e87; ModelTransform: 289.37,165.354,0,180,0,0,0,-15,0; Pins Structure: 1x2P; Pitch: 1.25mm; Number of PINs Per Row: 2; Current Rating: 1A; Voltage Rating: 125V; Plastic Material: LCP; Supplementary Features: 辅助焊脚; Z-Height of the Board: 4.7mm; X-Length of Bottom Edge on Board (Spacing Line): 7.5mm; Y-Width of Bottom Edge on Board: 4.3mm; Symbol: ZX-MX1.25-2PLT; Device: ZX-MX1.25-2PLT; LCSC Part Name: 1x2P 间距:1.25mm 立贴 系列:PicoBlade(MX 1.25); SupplierPart: C7430473; ManufacturerPart: ZX-MX1.25-2PLT; Supplier Footprint: SMD,P=1.25mm; JLCPCB Part Class: Extended Part; Datasheet: https://item.szlcsc.com/datasheet/ZX-MX1.25-2PLT/8430342.html; Supplier: LCSC; ConvertToPcb: yes; FootprintName: CONN-SMD_2P-P1.25-MX1.25-2P-LT; ModelName: CONN-SMD_2P-P1.25-MX1.25-2P-LT; Mounting Type: 立贴; Reference Series: PicoBlade(MX 1.25); Number of Pins: 2P; Number of Rows: 1; Row Spacing: -; Contact Material: 黄铜; Contact Plating: 锡; Operating Temperature: -25℃~+85℃; Flame Retardant Rating: -; Color: 米色
U24 U25 = ESD5341N_C20612964: Manufacturer: KUU; 3D Model: 2bdbcca3b35b49c5a8ae725a08658930; 3D Model Transform: 40.1574,24.4094,0,0,0,0,0,0,0; AddInBom: yes; Symbol: ESD5341N_C20612964; Device: ESD5341N_C20612964; LCSC Part Name: ESD静电保护管; Supplier Part: C20612964; Manufacturer Part: ESD5341N; Supplier Footprint: DFN1006-2L; JLCPCB Part Class: 扩展库; Datasheet: https://atta.szlcsc.com/upload/public/pdf/source/20240126/9EE8C033ACD76A81C21292FAA1DFE4C1.pdf; Supplier: LCSC; ConvertToPcb: yes; FootprintName: DFN1006-2L-BI; ModelName: DFN1006-2L-BI
U26-U28 = ESD5341N_C20612964: Manufacturer: KUU; AddInBom: yes; ModelId: 2bdbcca3b35b49c5a8ae725a08658930; ModelTransform: 40.1574,24.4094,0,0,0,0,0,0,0; Symbol: ESD5341N_C20612964; Device: ESD5341N_C20612964; LCSC Part Name: ESD静电保护管; SupplierPart: C20612964; ManufacturerPart: ESD5341N; Supplier Footprint: DFN1006-2L; JLCPCB Part Class: 扩展库; Datasheet: https://atta.szlcsc.com/upload/public/pdf/source/20240126/9EE8C033ACD76A81C21292FAA1DFE4C1.pdf; Supplier: LCSC; ConvertToPcb: yes; FootprintName: DFN1006-2L-BI; ModelName: DFN1006-2L-BI

## Sheet KEY_LED.schdoc: =
size A4; Symbol: Sheet-Symbol_A4; Company: 嘉立创EDA; Version: V1.0; Page Size: A4; @Project Name: RK3568B2地瓜派; @Page Count: 26; @Update Date: 2025-09-11; @Create Date: 2025-09-11; @Schematic Name: Schematic1; @Page No: 18; @Page Name: KEY/LED; Device: Sheet-Symbol_A4; Border: 1; Title Block Position: 3; Width: 1170; Height: 825; Region Start: 1; X Region Count: 6; Y Region Count: 4; Blade Width: 10; @Board Name: Board1; @Create Time: 22:14:46; @Update Time: 22:15:06; Organization: ORGANIZATION; Address1: ADDRESS 1; Address2: ADDRESS 2; Address3: ADDRESS 3; Address4: ADDRESS 4; Revision: V1.0.0; SheetNumber: 25; SheetTotal: 28
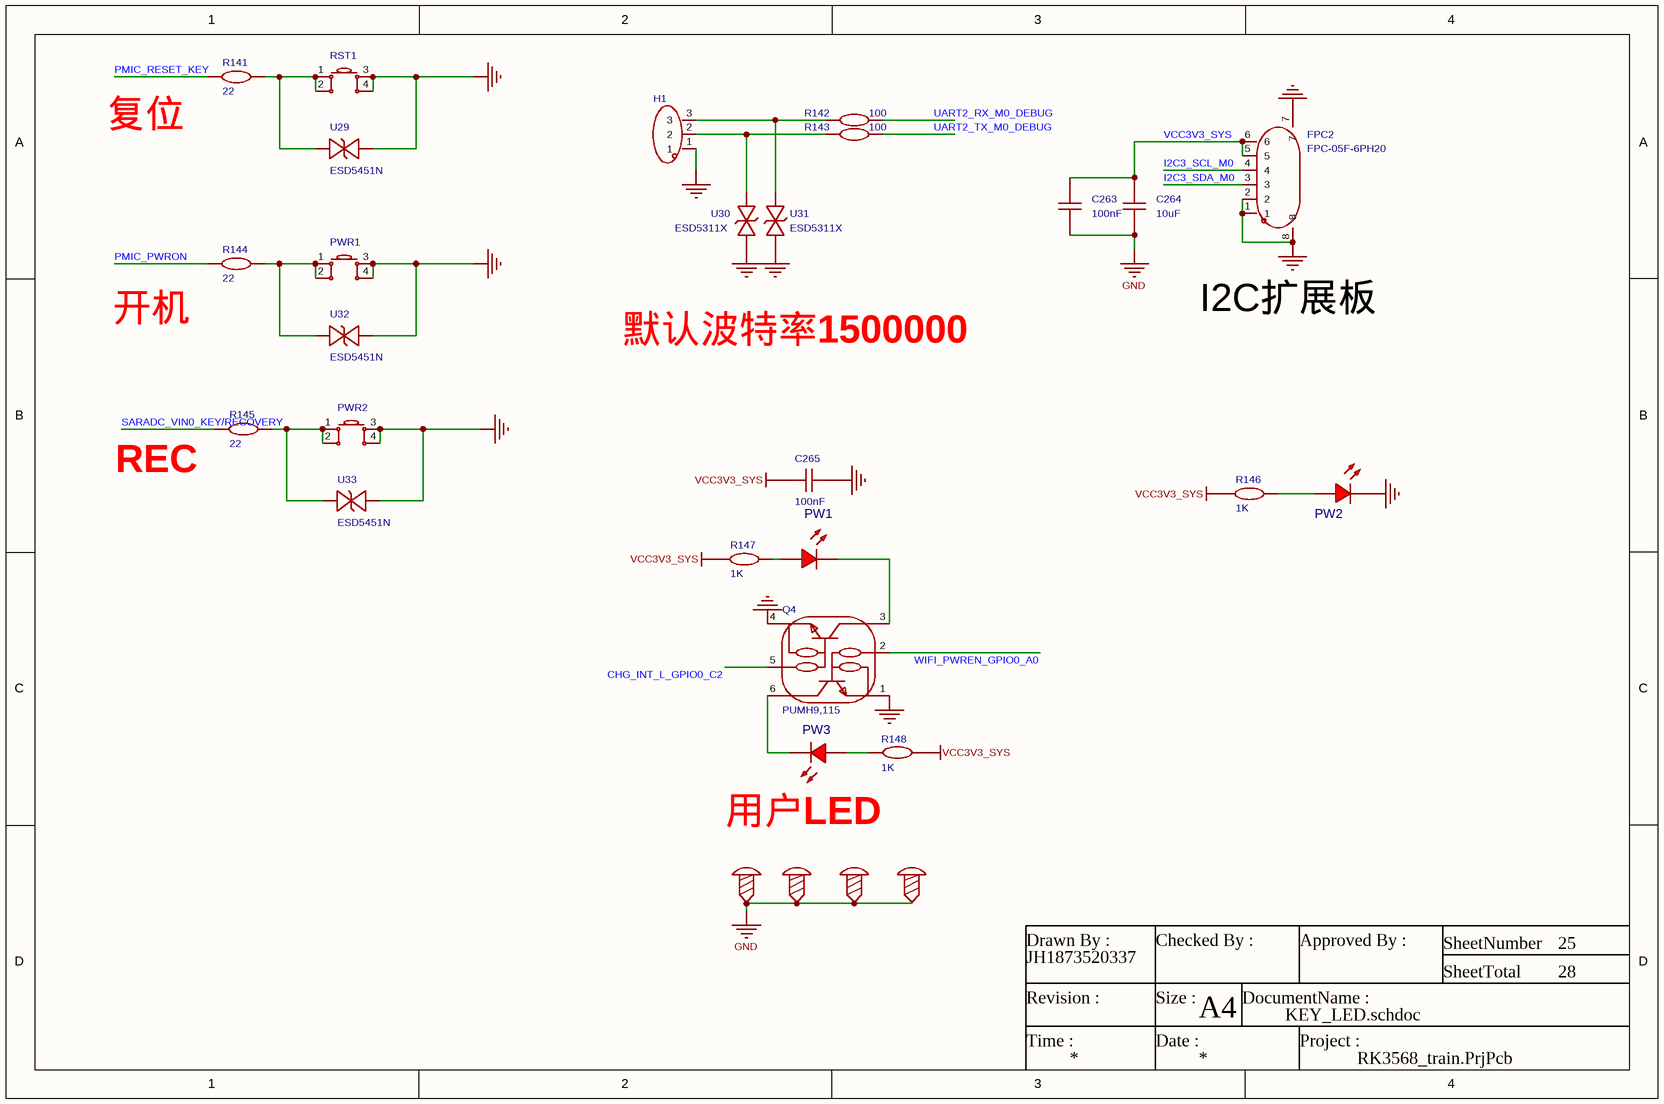
[diagram p24: KEY_LED.schdoc]

### Parts
C263  100nF  [C0603]
C264  10uF  [C0603]
C265  100nF  [C0603]
FPC2  FPC-05F-6PH20  [FPC-SMD_6P-P0.50_XUNPU_FPC-05F-6PH20]
H1  (no value)  [HDR-TH_3P-P2.54-V-M]
PW1  (no value)  [LED_0402]
PW2  (no value)  [LED_0402]
PW3  (no value)  [LED_0402]
PWR1  (no value)  [Key_SMD_4.2x3.2x2.5]
PWR2  (no value)  [Key_SMD_4.2x3.2x2.5]
Q4  PUMH9,115  [SOT-363_L2.0-W1.3-P0.65-LS2.1-BL]
R141  22  [R0402]
R142  100  [R0402]
R143  100  [R0402]
R144  22  [R0402]
R145  22  [R0402]
R146  1K  [R0402]
R147  1K  [R0402]
R148  1K  [R0402]
RST1  (no value)  [Key_SMD_4.2x3.2x2.5]
SCREW1  (no value)  [M3螺丝]
SCREW2  (no value)  [M3螺丝]
SCREW3  (no value)  [M3螺丝]
SCREW4  (no value)  [M3螺丝]
U29  ESD5451N  [X1-DFN1006-2_L1.0-W0.6-P0.65-BI]
U30  ESD5311X  [DFN1006-2L-BI]
U31  ESD5311X  [DFN1006-2L-BI]
U32  ESD5451N  [X1-DFN1006-2_L1.0-W0.6-P0.65-BI]
U33  ESD5451N  [X1-DFN1006-2_L1.0-W0.6-P0.65-BI]

### Nets
GND: C263.1 C264.1 C265.1 FPC2.1 FPC2.2 FPC2.7 FPC2.8 H1.1 PW2.1(C) PWR1.3 PWR1.4 PWR2.3 PWR2.4 Q4.1(E1) Q4.4(E2) RST1.3 RST1.4 SCREW1.1 SCREW2.1 SCREW3.1 SCREW4.1 U29.2 U30.2 U31.2 U32.2 U33.2
VCC3V3_SYS: C263.2 C264.2 C265.2 FPC2.5 FPC2.6 R146.1 R147.2 R148.1
CHG_INT_L_GPIO0_C2: Q4.5(B2)
I2C3_SCL_M0: FPC2.4
I2C3_SDA_M0: FPC2.3
PMIC_PWRON: R144.1
PMIC_RESET_KEY: R141.1
SARADC_VIN0_KEY/RECOVERY: R145.1
UART2_RX_M0_DEBUG: R142.2
UART2_TX_M0_DEBUG: R143.2
WIFI_PWREN_GPIO0_A0: Q4.2(B1)
NetH1_2: H1.2 R143.1 U30.1
NetH1_3: H1.3 R142.1 U31.1
NetPW1_1: PW1.1(C) Q4.3(C2)
NetPW1_2: PW1.2(A) R147.1
NetPW2_2: PW2.2(A) R146.2
NetPW3_1: PW3.1(C) Q4.6(C1)
NetPW3_2: PW3.2(A) R148.2
NetPWR1_1: PWR1.1 PWR1.2 R144.2 U32.1
NetPWR2_1: PWR2.1 PWR2.2 R145.2 U33.1
NetR141_2: R141.2 RST1.1 RST1.2 U29.1

### Notes on the sheet
- (near R141) 复位
- (near R144) 开机
- 默认波特率1500000
- (near FPC2) I2C扩展板
- (near R145) REC
- 用户LED
- Drawn By :
- Checked By :
- Approved By :
- SheetNumber
- SheetTotal
- Revision :
- Time :
- Size :
- Date :
- A4
- DocumentName :
- Project :

### Library data of the parts
C263 C264 = CAP_0603: Symbol: Capacitance; 3D Model: ac125912035d415993ca9572d50418b1聨0819f05c4eef4c71ace90d822a990e87; 3D Model Transform: 62.992,31.496,0,0,0,0,0,0,0; ConvertToPcb: yes; ModelName: C0603_L1.6-W0.8-H0.8; Device: CAP_0603; Supplier Footprint: 0603; AddInBom: yes; FootprintName: C0603
  C263: Value: 100nF
  C264: Value: 10uF
C265 = CAP_0603: Symbol: Capacitance; ConvertToPcb: yes; ModelId: ac125912035d415993ca9572d50418b1; ModelName: C0603_L1.6-W0.8-H0.8; ModelTransform: 62.992,31.496,0,0,0,0,0,0,0; Device: CAP_0603; AddInBom: yes; Supplier Footprint: 0603; FootprintName: C0603; Value: 100nF
FPC2 = FPC-05F-6PH20: 锁定特性:翻盖式;触点类型:下接;触点数量:6P;间距:0.5mm;安装类型:卧贴;工作温度范围:-25℃~+85℃;; Manufacturer: XUNPU(讯普); 3D Model: f0153d283bb647ab8cc6ddf5c8ee15be; 3D Model Transform: 291.338,220.472,0,0,0,0,-0.001,-45.276,0; Locking Feature: 翻盖式; Number of Contacts: 6P; Pitch: 0.5mm; FFC, FCB Thickness: 0.3mm; AddInBom: yes; LCSC Part Name: 间距:0.5mm P数:6P 翻盖式 下接; Supplier Part: C2856796; Manufacturer Part: FPC-05F-6PH20; Supplier Footprint: SMD,P=0.5mm,卧贴; JLCPCB Part Class: 扩展库; Datasheet: https://atta.szlcsc.com/upload/public/pdf/source/20210922/16B003FB53336DDF6538142CC465AC4D.pdf; Supplier: LCSC; Contact Type: 下接; Mounting Type: 卧贴; Height Above Board: 2mm; Operating Temperature Range: -25℃~+85℃; Symbol: FPC-05F-6PH20; Device: FPC-05F-6PH20; ConvertToPcb: yes; FootprintName: FPC-SMD_6P-P0.50_XUNPU_FPC-05F-6PH20; ModelName: FPC-SMD_6P-P0.50_XUNPU_FPC-05F-6PH20
H1 = HDR-M_2.54_1x3P: AddInBom: yes; ModelId: bb473b6d38ff42a99216a4fcdbdcc4cb; ModelName: HDR-TH_3P-P2.54-M-LI-1X3P; ModelTransform: 299.9993964861481,99.99979882871602,454.3297999999999,0,0,0,0,0,-118.11024; Symbol: HDR-M_2.54_1x3P; Device: HDR-M_2.54_1x3P; ConvertToPcb: yes; FootprintName: HDR-TH_3P-P2.54-V-M; SupplierPart: C2937625; Supplier Footprint: 插件
PW1-PW3 = LED_0402-R: Symbol: LED_R; Convert to PCB: yes; 3D Model: ff479c6f784e45d5abe8f8ff531b4a70; 3D Model Transform: 39.4,19.7,15.76,180,0,0,0,0,0; ModelName: LED0402-RD_ORANGE; Device: LED_0402-R; Add into BOM: yes; Supplier Footprint: 0402; FootprintName: LED_0402
PWR1 RST1 = Key_SMD_4.2x3.2x2.5: Symbol: 轻触按键; ConvertToPcb: yes; ModelId: 38f4e5ae1c0a49d7a4c1f95a650cdbea聨0819f05c4eef4c71ace90d822a990e87; ModelName: KEY-SMD_4P-L4.2-W3.2-H2.5-LS4.6-P2.2; ModelTransform: 184.97,125.98,98.82,0,0,0,0,0,0; Device: Key_SMD_4.2x3.2x2.5; AddInBom: yes; Supplier Footprint: SMD; FootprintName: Key_SMD_4.2x3.2x2.5
PWR2 = Key_SMD_4.2x3.2x2.5: Symbol: 轻触按键; 3D Model: 38f4e5ae1c0a49d7a4c1f95a650cdbea聨0819f05c4eef4c71ace90d822a990e87; 3D Model Transform: 184.97,125.98,98.82,0,0,0,0,0,0; ConvertToPcb: yes; ModelName: KEY-SMD_4P-L4.2-W3.2-H2.5-LS4.6-P2.2; Device: Key_SMD_4.2x3.2x2.5; Supplier Footprint: SMD; AddInBom: yes; FootprintName: Key_SMD_4.2x3.2x2.5
Q4 = PUMH9,115: 晶体管类型:-;集射极击穿电压(Vceo):50V;集电极电流(Ic):100mA;功率(Pd):200mW;直流电流增益(hFE@Ic,Vce):100@5mA,5V;; Manufacturer: Nexperia(安世); AddInBom: yes; ModelId: ea15c7b026c54341854a7f0d9614aed9; ModelName: SOT-363-6P_L2.0-W1.3-H1.1-LS2.0-P0.65; ModelTransform: 83.17133,78.74,0,90,0,0,0,0,0; Collector-Emitter Breakdown Voltage (Vceo): 50V; Collector Current (Ic): 100mA; Power Dissipation (Pd): 200mW; Input Voltage (VI(on)@Ic,Vce): 800mV@1mA,0.3V; Input Voltage (VI(off)@Ic,Vce): 700mV@100uA,5V; Input Resistor: 10kΩ; Resistor Ratio: 4.7; Symbol: PUMH9,115; Device: PUMH9,115; LCSC Part Name: 耐压:50V 电流:100mA; SupplierPart: C426876; ManufacturerPart: PUMH9,115; Supplier Footprint: SOT-363; JLCPCB Part Class: 扩展库; Datasheet: https://atta.szlcsc.com/upload/public/pdf/source/20240724/03256FD06240C401B0BD478BA06DFF99.pdf; Supplier: LCSC; ConvertToPcb: yes; FootprintName: SOT-363_L2.0-W1.3-P0.65-LS2.1-BL; Transistor Type: -; DC Current Gain (hFE@Ic,Vce): 100@5mA,5V; Operating Temperature: -55℃~+150℃
R141 R144 R146-R148 = Res_0402: as R130-R133 on sheet EMMC; Device: Res_0402; AddInBom: yes; Supplier Footprint: 0402; FootprintName: R0402
  R141 R144: Value: 22
  R146-R148: Value: 1K
R142 R143 = Res_0402: 3D Model: 671aefced39d4c318694bba8bd8efd39; 3D Model Transform: 39.37,19.685,0,0,0,0,0,0.0005,0; Symbol: 电阻; ConvertToPcb: yes; ModelName: R0402_L1.0-W0.5-H0.5; Value: 100; Device: Res_0402; AddInBom: yes; Supplier Footprint: 0402; FootprintName: R0402
R145 = Res_0402: as R134 on sheet AUDIO; Device: Res_0402; Value: 22; Supplier Footprint: 0402; AddInBom: yes; FootprintName: R0402
SCREW1-SCREW4 = M3螺丝: Symbol: 螺丝孔; ConvertToPcb: yes; Supplier Footprint: 插件; Device: M3螺丝; AddInBom: yes; FootprintName: M3螺丝
U29 U32 = ESD5451N_C2936977: 极性:双向;反向截止电压(Vrwm):5V;钳位电压:13V;峰值脉冲电流(Ipp):5.5A;峰值脉冲功率(Ppp):90W;击穿电压:8.4V;; Manufacturer: TECH PUBLIC(台舟); AddInBom: yes; ModelId: e1a2843302f940e8ac07b7d637792d48; ModelTransform: 39.37,23.622,0,0,0,0,0,0,0; Polarity: 双向; Reverse Stand-Off Voltage (Vrwm): 5V; Clamping Voltage: 13V; Peak Pulse Current (Ipp): 5.5A; Peak Pulse Power Dissipation (Ppp): 90W; Voltage - Breakdown: 8.4V; Reverse Leakage Current (Ir): 80nA; Number of Channels: 单路; level of protection: IEC 61000-4-2; Symbol: ESD5451N_C2936977; Device: ESD5451N_C2936977; LCSC Part Name: ESD二极管; SupplierPart: C2936977; ManufacturerPart: ESD5451N; Supplier Footprint: DFN1006-2; JLCPCB Part Class: 扩展库; Datasheet: https://item.szlcsc.com/datasheet/ESD5451N/3290324.html; Supplier: LCSC; ConvertToPcb: yes; FootprintName: X1-DFN1006-2_L1.0-W0.6-P0.65-BI; ModelName: X1-DFN1006-2_L1.0-W0.6-P0.65-BI; Operating Temperature: -55℃~+125℃; Type: ESD
U30 U31 = ESD5311X_C2844730: 极性:双向;反向截止电压(Vrwm):5V;最大钳位电压:21V;峰值脉冲电流(Ipp):4A;峰值脉冲功率(Ppp):80W;击穿电压:7.5V;; Manufacturer: TECH PUBLIC(台舟); AddInBom: yes; ModelId: 2bdbcca3b35b49c5a8ae725a08658930; ModelTransform: 40.1574,24.4094,0,0,0,0,0,0,0; polarity: 双向; Reverse Stand-Off Voltage (Vrwm): 5V; Maximum Clamping Voltage: 21V; Peak Pulse Current (Ipp): 4A; Peak Pulse Power Dissipation (Ppp): 80W; Breakdown Voltage: 7.5V; Reverse Leakage Current (Ir): 80nA; Number of Lines: 单路; level of protection: IEC 61000-4-2; Symbol: ESD5311X_C2844730; Device: ESD5311X_C2844730; LCSC Part Name: ESD5311X; SupplierPart: C2844730; ManufacturerPart: ESD5311X; Supplier Footprint: DFN1006-2; JLCPCB Part Class: 扩展库; Datasheet: https://atta.szlcsc.com/upload/public/pdf/source/20210709/C2844730_C8067B3CCE558E7D499244211FB5DC21.pdf; Supplier: LCSC; ConvertToPcb: yes; FootprintName: DFN1006-2L-BI; ModelName: DFN1006-2L-BI; Operating Temperature: -55℃~+125℃; Type: ESD
U33 = ESD5451N_C2936977: 极性:双向;反向截止电压(Vrwm):5V;钳位电压:13V;峰值脉冲电流(Ipp):5.5A;峰值脉冲功率(Ppp):90W;击穿电压:8.4V;; Manufacturer: TECH PUBLIC(台舟); 3D Model: e1a2843302f940e8ac07b7d637792d48; 3D Model Transform: 39.37,23.622,0,0,0,0,0,0,0; Polarity: 双向; Reverse Stand-Off Voltage (Vrwm): 5V; Clamping Voltage: 13V; Peak Pulse Current (Ipp): 5.5A; Peak Pulse Power Dissipation (Ppp): 90W; Voltage - Breakdown: 8.4V; Reverse Leakage Current (Ir): 80nA; Number of Channels: 单路; level of protection: IEC 61000-4-2; AddInBom: yes; Symbol: ESD5451N_C2936977; Device: ESD5451N_C2936977; LCSC Part Name: ESD二极管; Supplier Part: C2936977; Manufacturer Part: ESD5451N; Supplier Footprint: DFN1006-2; JLCPCB Part Class: 扩展库; Datasheet: https://item.szlcsc.com/datasheet/ESD5451N/3290324.html; Supplier: LCSC; Operating Temperature: -55℃~+125℃; Type: ESD; ConvertToPcb: yes; FootprintName: X1-DFN1006-2_L1.0-W0.6-P0.65-BI; ModelName: X1-DFN1006-2_L1.0-W0.6-P0.65-BI

## Sheet CAM.schdoc: =
size A4; Symbol: Sheet-Symbol_A4; Company: 嘉立创EDA; Version: V1.0; Page Size: A4; @Project Name: RK3568B2地瓜派; @Page Count: 27; @Update Date: 2025-09-11; @Create Date: 2025-09-11; @Schematic Name: Schematic1; @Page No: 26; @Page Name: CAM; Device: Sheet-Symbol_A4; Border: 1; Title Block Position: 3; Width: 1170; Height: 825; Region Start: 1; X Region Count: 6; Y Region Count: 4; Blade Width: 10; @Board Name: Board1; @Create Time: 22:44:02; @Update Time: 22:48:10; Organization: ORGANIZATION; Address1: ADDRESS 1; Address2: ADDRESS 2; Address3: ADDRESS 3; Address4: ADDRESS 4; Revision: V1.0.0; SheetNumber: 26; SheetTotal: 28
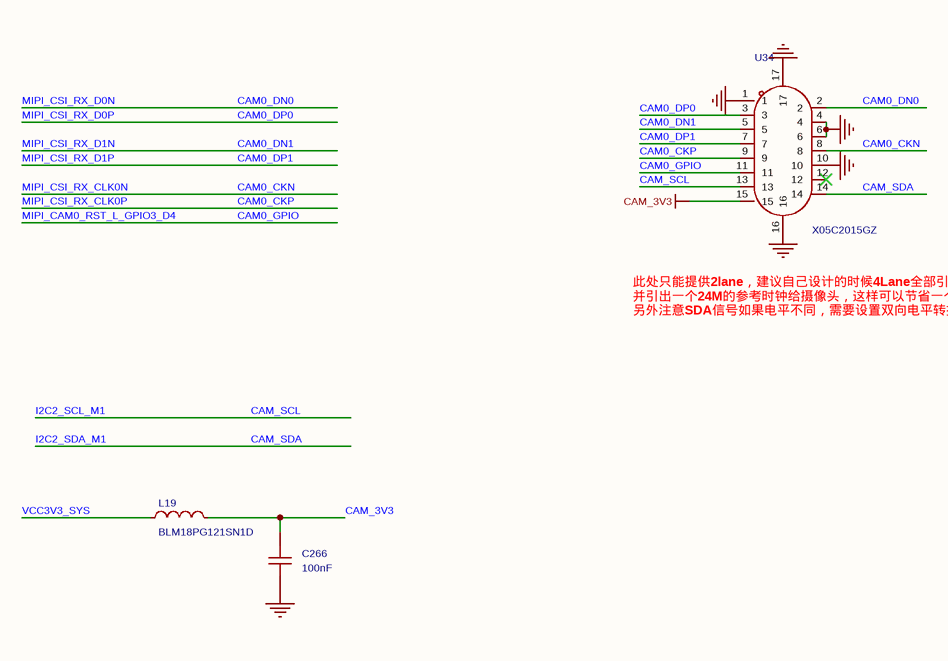
[diagram p25: CAM.schdoc]

### Parts
C266  100nF  [C0603]
L19  BLM18PG121SN1D  [L0603]
U34  X05C2015GZ  [FPC-SMD_15P-P0.50_XKB_X05C2015GZ]

### Nets
CAM_3V3: C266.2 L19.2 U34.15
GND: C266.1 U34.1 U34.4 U34.6 U34.10 U34.16 U34.17
VCC3V3_SYS: L19.1
CAM0_CKN: U34.8  [also labelled MIPI_CSI_RX_CLK0N]
CAM0_CKP: U34.9  [also labelled MIPI_CSI_RX_CLK0P]
CAM0_DN0: U34.2  [also labelled MIPI_CSI_RX_D0N]
CAM0_DN1: U34.5  [also labelled MIPI_CSI_RX_D1N]
CAM0_DP0: U34.3  [also labelled MIPI_CSI_RX_D0P]
CAM0_DP1: U34.7  [also labelled MIPI_CSI_RX_D1P]
CAM0_GPIO: U34.11  [also labelled MIPI_CAM0_RST_L_GPIO3_D4]
CAM_SCL: U34.13  [also labelled I2C2_SCL_M1]
CAM_SDA: U34.14  [also labelled I2C2_SDA_M1]

Not connected (* = marked no-connect by the designer): U34 12*

### Notes on the sheet
- 此处只能提供2lane，建议自己设计的时候4Lane全部引出
  并引出一个24M的参考时钟给摄像头，这样可以节省一个有源晶振
  另外注意SDA信号如果电平不同，需要设置双向电平转换
- Drawn By :
- Checked By :
- Approved By :
- SheetNumber
- SheetTotal
- Revision :
- Time :
- Size :
- Date :
- A4
- DocumentName :
- Project :

### Library data of the parts
C266 = CAP_0603: ConvertToPcb: yes; SymbolName: Capacitance; ModelId: ac125912035d415993ca9572d50418b1; ModelName: C0603_L1.6-W0.8-H0.8; ModelTransform: 62.992,31.496,0,0,0,0,0,0,0; Device: CAP_0603; AddInBom: yes; Supplier Footprint: 0603; FootprintName: C0603; Value: 100nF
L19 = BLM18PG121SN1D: 标称阻抗@测试频率:120Ω@100MHz;误差:±25%;直流电阻(RDC):50mΩ;; Manufacturer: muRata(村田); DC Resistance(DCR): 50mΩ; Number of Circuits: 1; Symbol: BLM18PG121SN1D_C14709; AddInBom: yes; ModelId: 2bc5ec593d464d6ba9807aec0b5673c2; ModelName: L0603_L1.6-W0.8-H0.5_BEAD; ModelTransform: 62.992,31.496,0,180,0,0,0.094,0.629,0; Tolerance: ±25%; Current Rating: 2A; Operating Temperature: -55℃~+125℃; Device: BLM18PG121SN1D; LCSC Part Name: 单路 0603磁珠 阻抗120Ω@100MHz; SupplierPart: C14709; ManufacturerPart: BLM18PG121SN1D; Supplier Footprint: 0603; JLCPCB Part Class: 基础库; Datasheet: https://atta.szlcsc.com/upload/public/pdf/source/20130704/1457706621422.pdf; Supplier: LCSC; ConvertToPcb: yes; FootprintName: L0603; Impedance @ Frequency: 120Ω@100MHz; DC Resistance: 50mΩ; Circuits: 1
U34 = X05C2015GZ: 锁定特性:抽屉式;触点类型:单侧触点/垂直;触点数量:15P;间距:0.5mm;安装方式:立贴;工作温度:-40℃~+85℃;; Manufacturer: XKB Connection(中国星坤); AddInBom: yes; ModelId: da5f495125dc49909a9ff79830e9b65f; ModelTransform: 515.747,118.11,0,0,0,0,0,0,0; Locking Feature: 抽屉式; Number of Contacts: 15P; Pitch: 0.5mm; FFC, FCB Thickness: 0.3mm; Symbol: X05C2015GZ; Device: X05C2015GZ; LCSC Part Name: 间距:0.5mm P数:15P 抽屉式 单侧触点/垂直; SupplierPart: C2880899; ManufacturerPart: X05C2015GZ; Supplier Footprint: SMD,P=0.5mm; JLCPCB Part Class: 扩展库; Datasheet: https://atta.szlcsc.com/upload/public/pdf/source/20211011/FB814D820E44B2E0BC67EE682E3C499B.pdf; Supplier: LCSC; ConvertToPcb: yes; FootprintName: FPC-SMD_15P-P0.50_XKB_X05C2015GZ; ModelName: FPC-SMD_15P-P0.50_XKB_X05C2015GZ; Contact Type: 单侧触点/垂直; Mounting Type: 立贴; Height Above Board: 2mm; Contact Material: 磷青铜; Contact Plating: 金; Operating Temperature: -40℃~+85℃

## Sheet DISPLAY.schdoc: =
size A4; Symbol: Sheet-Symbol_A4; Company: 嘉立创EDA; Version: V1.0; Page Size: A4; @Project Name: RK3568B2地瓜派; @Page Count: 27; @Update Date: 2025-09-23; @Create Date: 2025-09-11; @Schematic Name: Schematic1; @Page No: 25; @Page Name: DISPLAY; Device: Sheet-Symbol_A4; Border: 1; Title Block Position: 3; Width: 1170; Height: 825; Region Start: 1; X Region Count: 6; Y Region Count: 4; Blade Width: 10; @Board Name: Board1; @Create Time: 22:43:50; @Update Time: 10:18:57; Organization: ORGANIZATION; Address1: ADDRESS 1; Address2: ADDRESS 2; Address3: ADDRESS 3; Address4: ADDRESS 4; Revision: V1.0.0; SheetNumber: 27; SheetTotal: 28
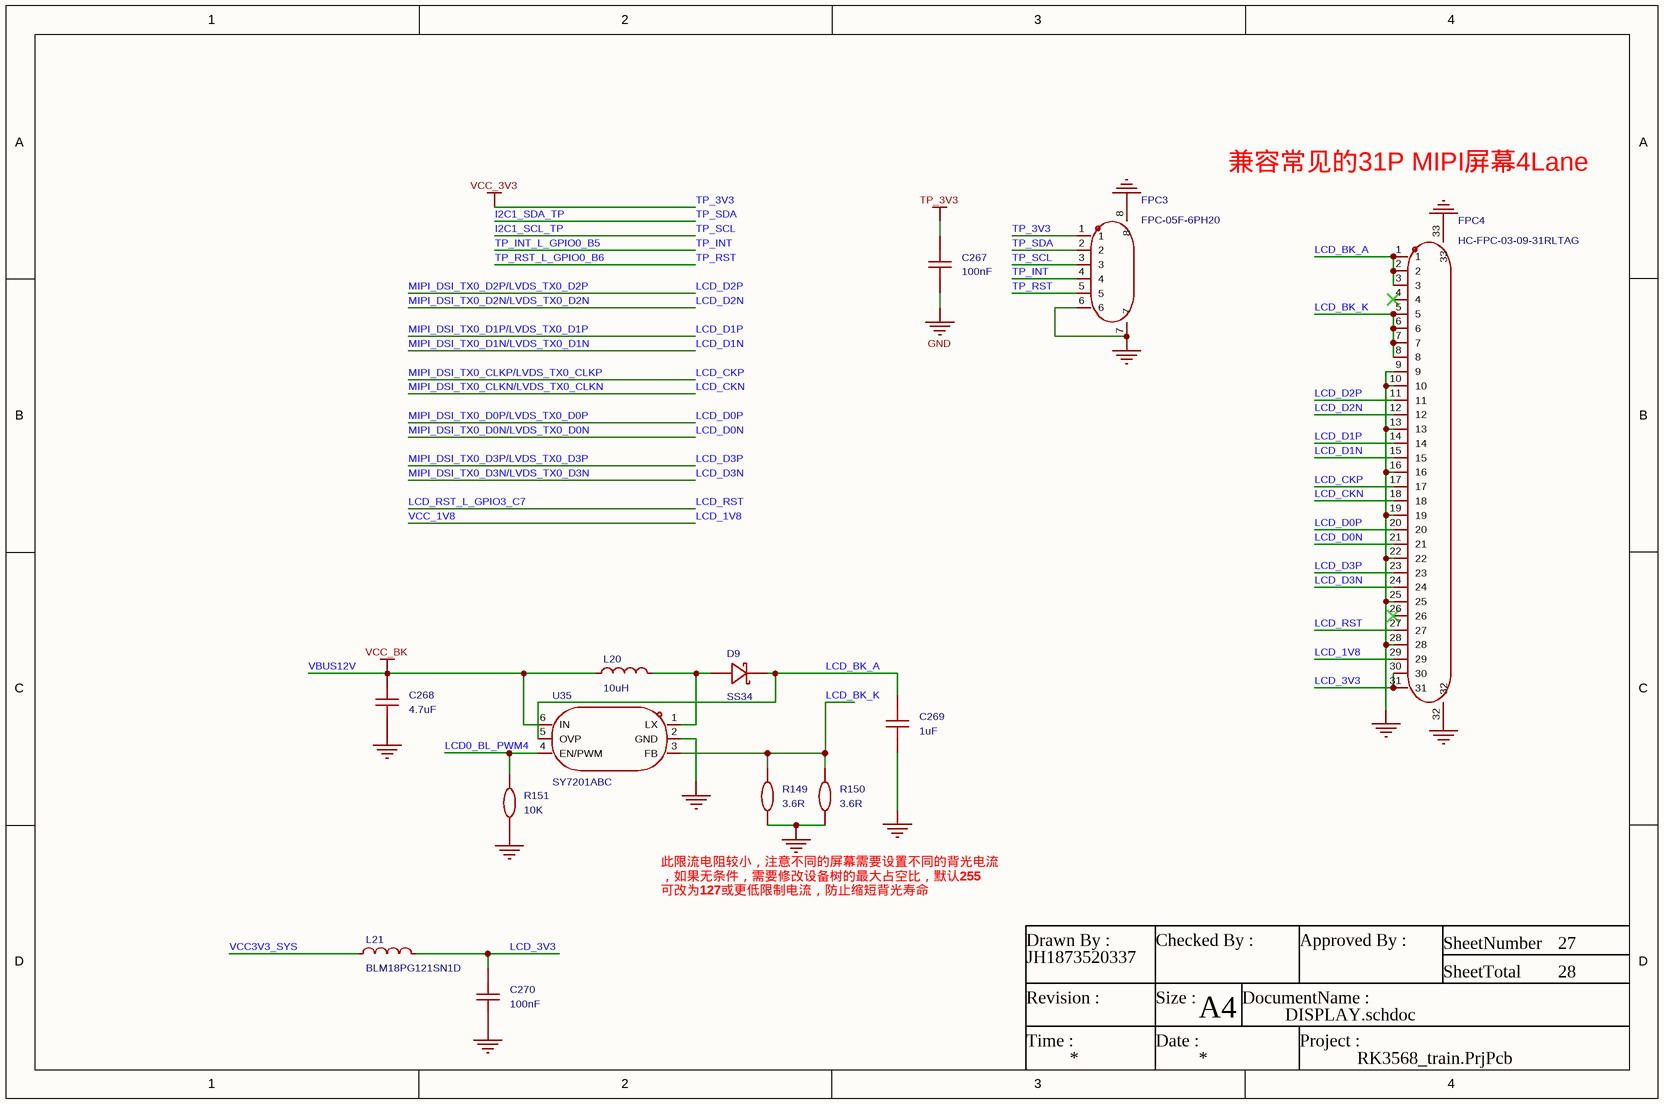
[diagram p26: DISPLAY.schdoc]

### Parts
C267  100nF  [C0603]
C268  4.7uF  [C0603]
C269  1uF  [C0603]
C270  100nF  [C0603]
D9  SS34  [SMA_L4.3-W2.6-LS5.0-FD]
FPC3  FPC-05F-6PH20  [FPC-SMD_6P-P0.50_XUNPU_FPC-05F-6PH20]
FPC4  HC-FPC-03-09-31RLTAG  [FPC-SMD_31P-P0.30_HC-FPC-03-09-31RLTAG]
L20  10uH  [IND-SMD_L2.5-W2.0]
L21  BLM18PG121SN1D  [L0603]
R149  3.6R  [R0603]
R150  3.6R  [R0603]
R151  10K  [R0402]
U35  SY7201ABC  [SOT-23-6_L2.9-W1.6-P0.95-LS2.8-BR]

### Nets
GND: C267.1 C268.1 C269.1 C270.1 FPC3.6 FPC3.7 FPC3.8 FPC4.9 FPC4.10 FPC4.13 FPC4.16 FPC4.19 FPC4.22 FPC4.25 FPC4.28 FPC4.32 FPC4.33 R149.1 R150.1 R151.1 U35.2(GND)
LCD_1V8: FPC4.29  [also labelled VCC_1V8]
TP_3V3: C267.2 FPC3.1  [also labelled VCC_3V3]
VBUS12V: C268.2 L20.2 U35.6(IN)  [also labelled VCC_BK]
VCC3V3_SYS: L21.1
I2C1_SCL_TP: FPC3.3  [also labelled TP_SCL]
I2C1_SDA_TP: FPC3.2  [also labelled TP_SDA]
LCD0_BL_PWM4: R151.2 U35.4(EN/PWM)
LCD_3V3: C270.2 FPC4.30 FPC4.31 L21.2
LCD_BK_A: C269.2 D9.2(K) FPC4.1 FPC4.2 FPC4.3 U35.5(OVP)
LCD_BK_K: FPC4.5 FPC4.6 FPC4.7 FPC4.8 R149.2 R150.2 U35.3(FB)
LCD_CKN: FPC4.18  [also labelled MIPI_DSI_TX0_CLKN/LVDS_TX0_CLKN]
LCD_CKP: FPC4.17  [also labelled MIPI_DSI_TX0_CLKP/LVDS_TX0_CLKP]
LCD_D0N: FPC4.21  [also labelled MIPI_DSI_TX0_D0N/LVDS_TX0_D0N]
LCD_D0P: FPC4.20  [also labelled MIPI_DSI_TX0_D0P/LVDS_TX0_D0P]
LCD_D1N: FPC4.15  [also labelled MIPI_DSI_TX0_D1N/LVDS_TX0_D1N]
LCD_D1P: FPC4.14  [also labelled MIPI_DSI_TX0_D1P/LVDS_TX0_D1P]
LCD_D2N: FPC4.12  [also labelled MIPI_DSI_TX0_D2N/LVDS_TX0_D2N]
LCD_D2P: FPC4.11  [also labelled MIPI_DSI_TX0_D2P/LVDS_TX0_D2P]
LCD_D3N: FPC4.24  [also labelled MIPI_DSI_TX0_D3N/LVDS_TX0_D3N]
LCD_D3P: FPC4.23  [also labelled MIPI_DSI_TX0_D3P/LVDS_TX0_D3P]
LCD_RST: FPC4.27  [also labelled LCD_RST_L_GPIO3_C7]
TP_INT: FPC3.4  [also labelled TP_INT_L_GPIO0_B5]
TP_RST: FPC3.5  [also labelled TP_RST_L_GPIO0_B6]
NetD9_1: D9.1(A) L20.1 U35.1(LX)

Not connected (* = marked no-connect by the designer): FPC4 4* 26*

### Notes on the sheet
- 兼容常见的31P MIPI屏幕4Lane
- 此限流电阻较小，注意不同的屏幕需要设置不同的背光电流
  ，如果无条件，需要修改设备树的最大占空比，默认255
  可改为127或更低限制电流，防止缩短背光寿命
- Drawn By :
- Checked By :
- Approved By :
- SheetNumber
- SheetTotal
- Revision :
- Time :
- Size :
- Date :
- A4
- DocumentName :
- Project :

### Library data of the parts
C267 = CAP_0603: as C263 on sheet KEY_LED; Device: CAP_0603; Supplier Footprint: 0603; Value: 100nF; AddInBom: yes; FootprintName: C0603
C268-C270 = CAP_0603: as C266 on sheet CAM; Device: CAP_0603; AddInBom: yes; Supplier Footprint: 0603; FootprintName: C0603
  C268: Value: 4.7uF
  C269: Value: 1uF
  C270: Value: 100nF
D9 = SS34_C7420365: 二极管配置:独立式;正向压降(Vf):550mV@3.0A;直流反向耐压(Vr):40V;平均整流电流(Io):3A;; Manufacturer: 宏迦橙; Voltage - DC Reverse(Vr): 40V; Current - Rectified: 3A; AddInBom: yes; ModelId: 7e24bebe6cd74171ae8c9de6fc5b78aa; ModelTransform: 198.4248,103.5431,0,180,0,0,0,0,0; Diode Configuration: 独立式; Reverse Leakage Current (Ir): 200uA@40V; Peak forward surge current: 80A; Voltage - Forward(Vf@If): 550mV@3.0A; Symbol: SS34_C7420365; Device: SS34_C7420365; LCSC Part Name: 电压:40V 电流:3A; SupplierPart: C7420365; ManufacturerPart: SS34; Supplier Footprint: SMA(DO-214AC); JLCPCB Part Class: 扩展库; Datasheet: https://atta.szlcsc.com/upload/public/pdf/source/20230828/75438452AEE6C276EDA92B2AF599BE05.pdf; Supplier: LCSC; ConvertToPcb: yes; FootprintName: SMA_L4.3-W2.6-LS5.0-FD; ModelName: SMA_L4.3-W2.6-LS5.0-FD; Forward Voltage (Vf@If): 550mV@3.0A; Reverse Voltage (Vr): 40V; Average Rectified Current (Io): 3A
FPC3 = FPC-05F-6PH20: 锁定特性:翻盖式;触点类型:下接;触点数量:6P;间距:0.5mm;安装类型:卧贴;工作温度范围:-25℃~+85℃;; Manufacturer: XUNPU(讯普); AddInBom: yes; ModelId: f0153d283bb647ab8cc6ddf5c8ee15be; ModelTransform: 291.338,220.472,0,0,0,0,-0.001,-45.276,0; Locking Feature: 翻盖式; Number of Contacts: 6P; Pitch: 0.5mm; FFC, FCB Thickness: 0.3mm; Symbol: FPC-05F-6PH20; Device: FPC-05F-6PH20; LCSC Part Name: 间距:0.5mm P数:6P 翻盖式 下接; SupplierPart: C2856796; ManufacturerPart: FPC-05F-6PH20; Supplier Footprint: SMD,P=0.5mm,卧贴; JLCPCB Part Class: 扩展库; Datasheet: https://atta.szlcsc.com/upload/public/pdf/source/20210922/16B003FB53336DDF6538142CC465AC4D.pdf; Supplier: LCSC; ConvertToPcb: yes; FootprintName: FPC-SMD_6P-P0.50_XUNPU_FPC-05F-6PH20; ModelName: FPC-SMD_6P-P0.50_XUNPU_FPC-05F-6PH20; Contact Type: 下接; Mounting Type: 卧贴; Height Above Board: 2mm; Operating Temperature Range: -25℃~+85℃
FPC4 = HC-FPC-03-09-31RLTAG: 锁定特性:翻盖式;触点类型:下接;触点数量:31P;间距:0.3mm;安装方式:卧贴;工作温度:-55℃~+85℃;; Manufacturer: HCTL(华灿天禄); AddInBom: yes; ModelId: 8147d33ff0454235b0911f8aacb2567f; ModelTransform: 453.1487,167.3225,0,0,0,0,0,-13.78,0; Locking Feature: 翻盖式; Number of Contacts: 31P; Pitch: 0.3mm; FFC, FCB Thickness: 0.2mm; Symbol: HC-FPC-03-09-31RLTAG; Device: HC-FPC-03-09-31RLTAG; LCSC Part Name: 翻盖式 下接 P数:31P 间距:0.3mm; SupplierPart: C5213720; ManufacturerPart: HC-FPC-03-09-31RLTAG; Supplier Footprint: SMD,P=0.3mm,卧贴; JLCPCB Part Class: 扩展库; Datasheet: https://item.szlcsc.com/datasheet/HC-FPC-03-09-31RLTAG/5909012.html; Supplier: LCSC; ConvertToPcb: yes; FootprintName: FPC-SMD_31P-P0.30_HC-FPC-03-09-31RLTAG; ModelName: FPC-SMD_31P-P0.30_HC-FPC-03-09-31RLTAG; Contact Type: 下接; Mounting Type: 卧贴; Height Above Board: 1mm; Contact Material: 磷青铜; Operating Temperature: -55℃~+85℃
L20 = FTC252012S100MBCA: 电感值:10uH;精度:±20%;额定电流:1.2A;饱和电流(Isat):1.6A;类型:一体成型电感;; Manufacturer: cjiang(长江微电); AddInBom: yes; ModelId: 85d117b4abb34d9087271edcd9ba0330; ModelName: IND-SMD_L2.5-W2.0-H1.2; ModelTransform: 99.2124,78.74,0,0,0,0,0,0,0; Tolerance: ±20%; Rated Current: 1.2A; Saturation Current (Isat): 1.6A; DC Resistance (DCR): 330mΩ; Type: 一体成型电感; Symbol: FTC252012S100MBCA; Device: FTC252012S100MBCA; LCSC Part Name: 10uH ±20% 1.6A; SupplierPart: C5832376; ManufacturerPart: FTC252012S100MBCA; Supplier Footprint: SMD,2x2.5mm; JLCPCB Part Class: 扩展库; Datasheet: https://atta.szlcsc.com/upload/public/pdf/source/20230602/8FFEDA9C0247A92A0D4B67554BFE4091.pdf; Supplier: LCSC; ConvertToPcb: yes; FootprintName: IND-SMD_L2.5-W2.0; Value: 10uH
L21 = BLM18PG121SN1D: as L19 on sheet CAM; Operating Temperature: -55℃~+125℃; Device: BLM18PG121SN1D; LCSC Part Name: 单路 0603磁珠 阻抗120Ω@100MHz; SupplierPart: C14709; ManufacturerPart: BLM18PG121SN1D; Supplier Footprint: 0603; JLCPCB Part Class: 基础库; Datasheet: https://atta.szlcsc.com/upload/public/pdf/source/20130704/1457706621422.pdf; Supplier: LCSC; ConvertToPcb: yes; FootprintName: L0603; Impedance @ Frequency: 120Ω@100MHz; DC Resistance: 50mΩ; Circuits: 1
R149 R150 = Res_0603: Symbol: 电阻; ConvertToPcb: yes; ModelId: fc143cca1e79419f9cd78b61e9279f08; ModelTransform: 31.8897,63.7794,0,90,0,0,0,0,0; Value: 3.6R; Device: Res_0603; AddInBom: yes; Supplier Footprint: 0603; FootprintName: R0603; ModelName: R0603
R151 = Res_0402: as R130-R133 on sheet EMMC; Device: Res_0402; AddInBom: yes; Supplier Footprint: 0402; FootprintName: R0402; Value: 10K
U35 = SY7201ABC: 拓扑结构:升压;; Manufacturer: Silergy(矽力杰); AddInBom: yes; ModelId: 18da8f6c14a34920b3e136b5c401a119; ModelName: SOT-23-6_L2.9-W1.6-H1.5-LS2.8-P0.95; ModelTransform: 110.73671,114.173,0,180,0,0,0.001,-0.003,0; Topology: 升压; Symbol: SY7201ABC; Device: SY7201ABC; LCSC Part Name: SY7201ABC; SupplierPart: C82173; ManufacturerPart: SY7201ABC; Supplier Footprint: SOT-23-6; JLCPCB Part Class: 扩展库; Datasheet: https://atta.szlcsc.com/upload/public/pdf/source/20160903/1472896628181.pdf; Supplier: LCSC; ConvertToPcb: yes; FootprintName: SOT-23-6_L2.9-W1.6-P0.95-LS2.8-BR